# EAGLE design Main_board (EAGLE 9.6.2)

## Sheet 1 of 3
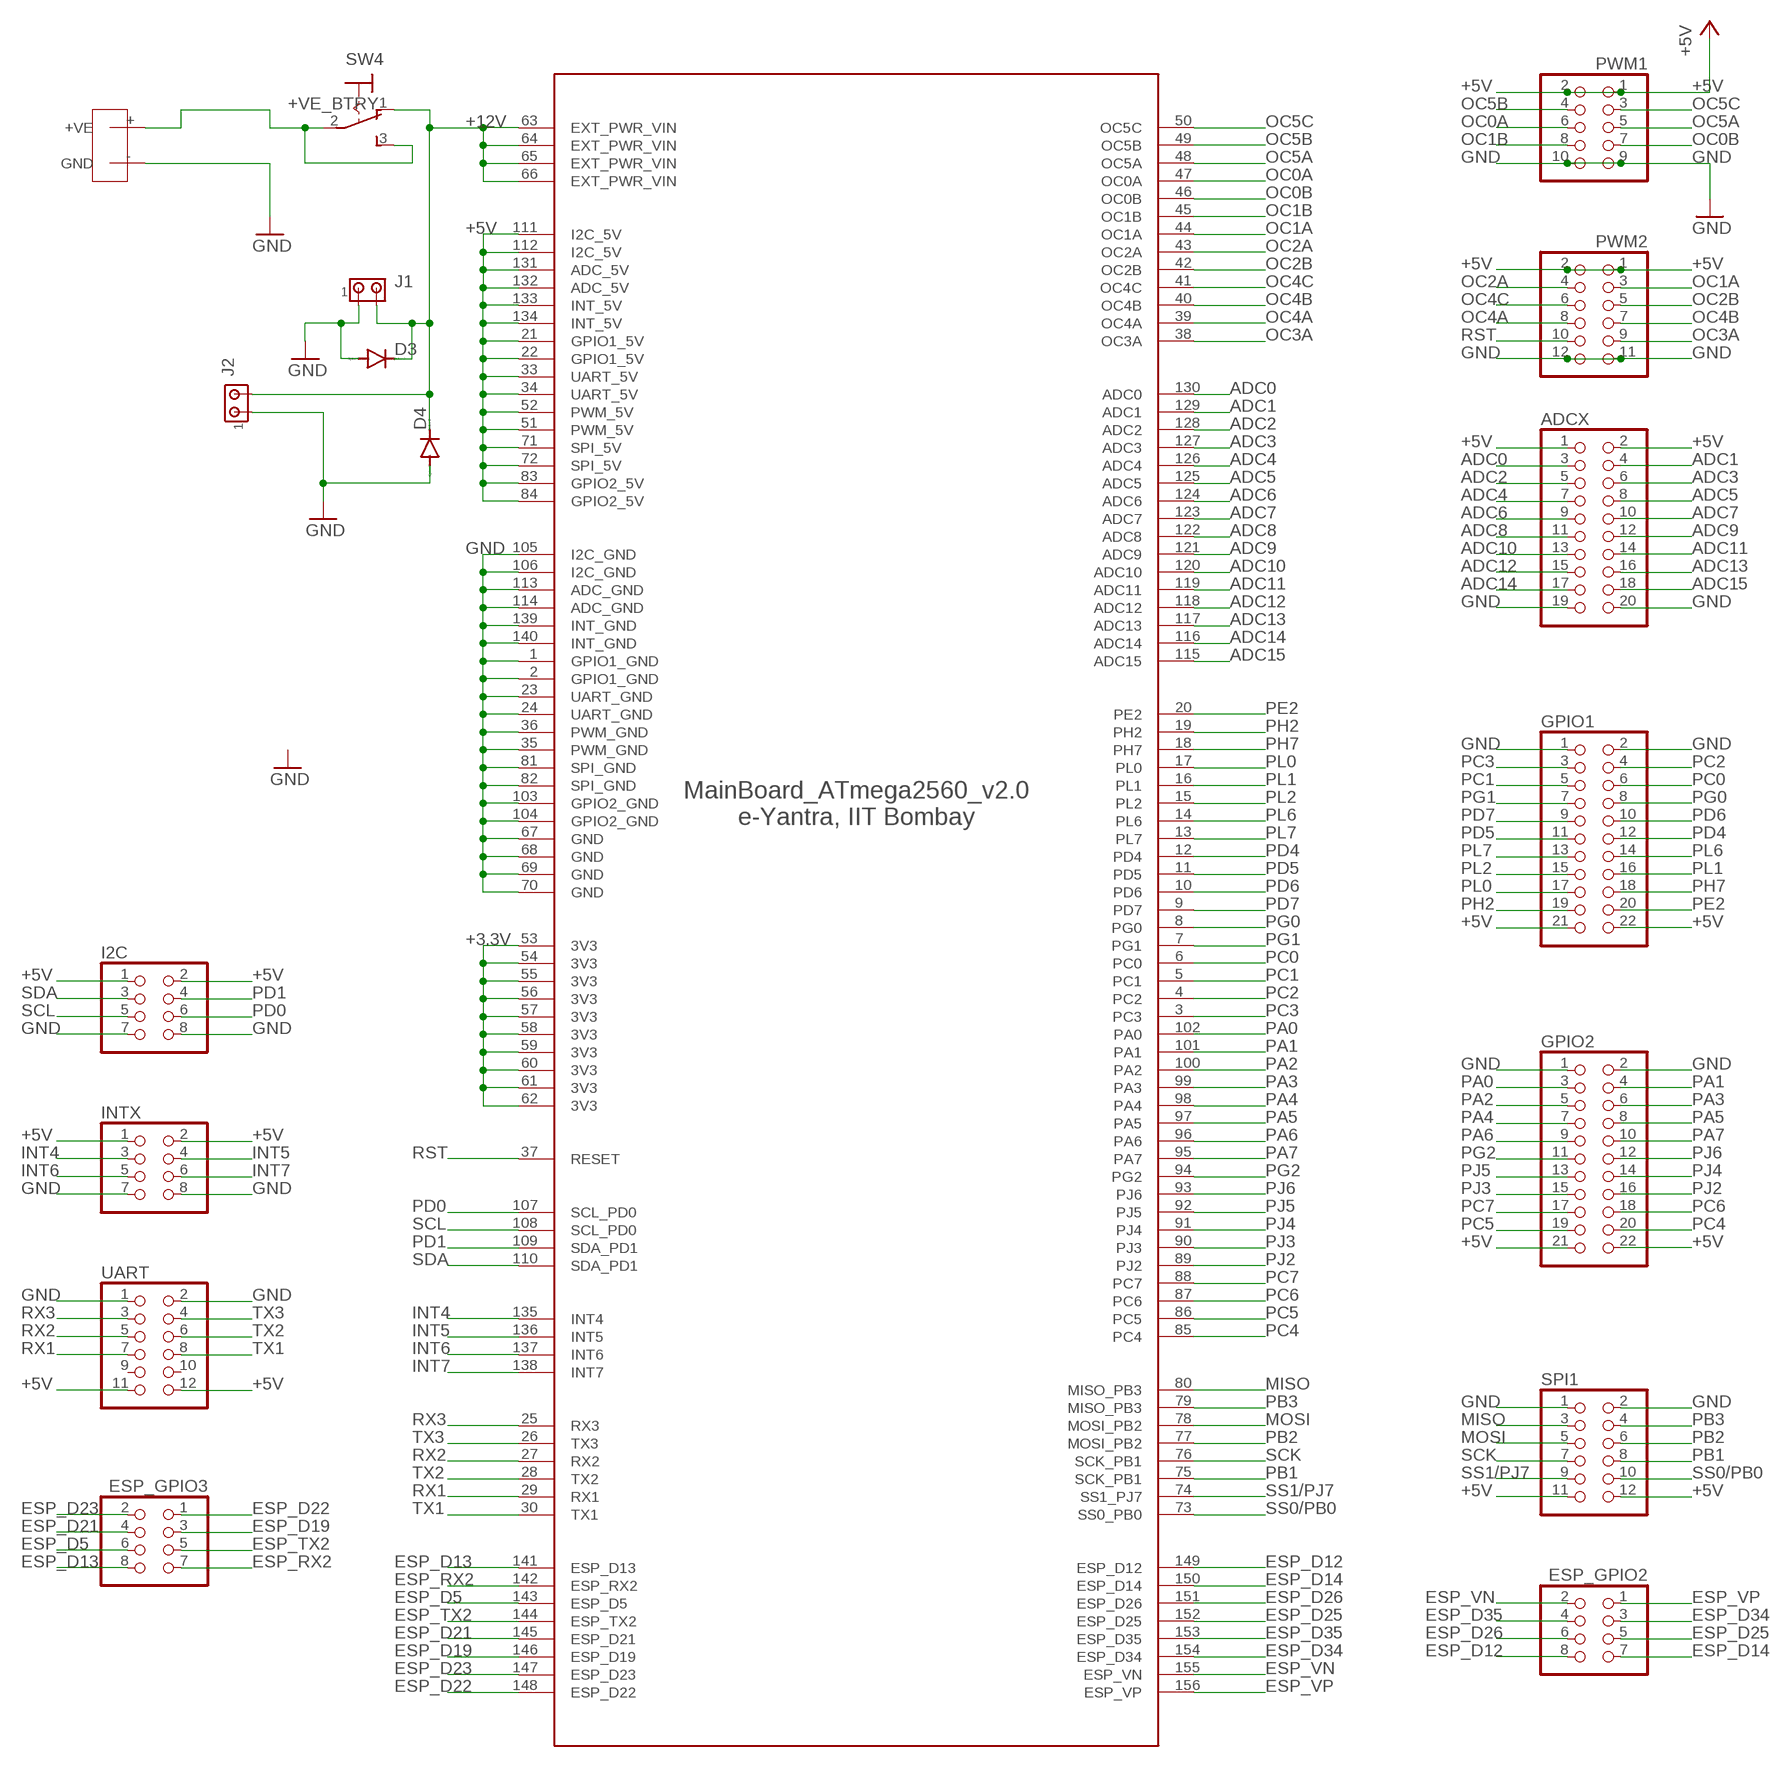
[diagram p0: schematic, sheet 1]

### Parts
ADCX  PINHD-2X10  [2X10]
D3  DIODE-DO214AC  [DO214AC]
D4  DIODE-DO214AC  [DO214AC]
ESP_GPIO2  PINHD-2X4  [2X04]
ESP_GPIO3  PINHD-2X4  [2X04]
EYFI_MEGA  ATMEGA2560_V2.0  [ATMEGA2560_V2.0]
GPIO1  PINHD-2X11  [2X11]
GPIO2  PINHD-2X11  [2X11]
I2C  PINHD-2X4  [2X04]
INTX  PINHD-2X4  [2X04]
J1  MTA02-156  [1X2MTA]
J2  MTA02-156  [1X2MTA]
PWM1  PINHD-2X5  [2X05]
PWM2  PINHD-2X6  [2X06]
SPI1  PINHD-2X6  [2X06]
SW4  M9040P  [M9040P]
U$1  DEANS  [DEANS]
UART  PINHD-2X6  [2X06]

### Nets
+3.3V: EYFI_MEGA.53(3V3) EYFI_MEGA.54(3V3) EYFI_MEGA.55(3V3) EYFI_MEGA.56(3V3) EYFI_MEGA.57(3V3) EYFI_MEGA.58(3V3) EYFI_MEGA.59(3V3) EYFI_MEGA.60(3V3) EYFI_MEGA.61(3V3) EYFI_MEGA.62(3V3) ; also sheet 2
+5V [+5V_SUPPLY]: ADCX.1 ADCX.2 EYFI_MEGA.21(GPIO1_5V) EYFI_MEGA.22(GPIO1_5V) EYFI_MEGA.33(UART_5V) EYFI_MEGA.34(UART_5V) EYFI_MEGA.51(PWM_5V) EYFI_MEGA.52(PWM_5V) EYFI_MEGA.71(SPI_5V) EYFI_MEGA.72(SPI_5V) EYFI_MEGA.83(GPIO2_5V) EYFI_MEGA.84(GPIO2_5V) EYFI_MEGA.111(I2C_5V) EYFI_MEGA.112(I2C_5V) EYFI_MEGA.131(ADC_5V) EYFI_MEGA.132(ADC_5V) EYFI_MEGA.133(INT_5V) EYFI_MEGA.134(INT_5V) GPIO1.21 GPIO1.22 GPIO2.21 GPIO2.22 I2C.1 I2C.2 INTX.1 INTX.2 PWM1.1 PWM1.2 PWM2.1 PWM2.2 SPI1.11 SPI1.12 UART.11 UART.12 ; also sheet 2
+12V [+12V_SUPPLY]: D3.C D4.C EYFI_MEGA.63(EXT_PWR_VIN) EYFI_MEGA.64(EXT_PWR_VIN) EYFI_MEGA.65(EXT_PWR_VIN) EYFI_MEGA.66(EXT_PWR_VIN) J1.2 J2.2 SW4.1(O)
+VE_BTRY [+12V_SUPPLY]: SW4.2(P) SW4.3(S) U$1.+(+VE)
ADC0: ADCX.3 EYFI_MEGA.130(ADC0) ; also sheet 2
ADC1: ADCX.4 EYFI_MEGA.129(ADC1) ; also sheet 2
ADC2: ADCX.5 EYFI_MEGA.128(ADC2) ; also sheet 2
ADC3: ADCX.6 EYFI_MEGA.127(ADC3) ; also sheet 2
ADC4: ADCX.7 EYFI_MEGA.126(ADC4)
ADC5: ADCX.8 EYFI_MEGA.125(ADC5)
ADC6: ADCX.9 EYFI_MEGA.124(ADC6)
ADC7: ADCX.10 EYFI_MEGA.123(ADC7)
ADC8: ADCX.11 EYFI_MEGA.122(ADC8)
ADC9: ADCX.12 EYFI_MEGA.121(ADC9)
ADC10: ADCX.13 EYFI_MEGA.120(ADC10)
ADC11: ADCX.14 EYFI_MEGA.119(ADC11)
ADC12: ADCX.15 EYFI_MEGA.118(ADC12) ; also sheet 2
ADC13: ADCX.16 EYFI_MEGA.117(ADC13) ; also sheet 2
ADC14: ADCX.17 EYFI_MEGA.116(ADC14) ; also sheet 2
ADC15: ADCX.18 EYFI_MEGA.115(ADC15) ; also sheet 2
ESP_D5: ESP_GPIO3.6 EYFI_MEGA.143(ESP_D5)
ESP_D12: ESP_GPIO2.8 EYFI_MEGA.149(ESP_D12)
ESP_D13: ESP_GPIO3.8 EYFI_MEGA.141(ESP_D13)
ESP_D14: ESP_GPIO2.7 EYFI_MEGA.150(ESP_D14)
ESP_D19: ESP_GPIO3.3 EYFI_MEGA.146(ESP_D19)
ESP_D21: ESP_GPIO3.4 EYFI_MEGA.145(ESP_D21)
ESP_D22: ESP_GPIO3.1 EYFI_MEGA.148(ESP_D22)
ESP_D23: ESP_GPIO3.2 EYFI_MEGA.147(ESP_D23)
ESP_D25: ESP_GPIO2.5 EYFI_MEGA.152(ESP_D25)
ESP_D26: ESP_GPIO2.6 EYFI_MEGA.151(ESP_D26)
ESP_D34: ESP_GPIO2.3 EYFI_MEGA.154(ESP_D34)
ESP_D35: ESP_GPIO2.4 EYFI_MEGA.153(ESP_D35)
ESP_RX2: ESP_GPIO3.7 EYFI_MEGA.142(ESP_RX2)
ESP_TX2: ESP_GPIO3.5 EYFI_MEGA.144(ESP_TX2)
ESP_VN: ESP_GPIO2.2 EYFI_MEGA.155(ESP_VN)
ESP_VP: ESP_GPIO2.1 EYFI_MEGA.156(ESP_VP)
GND: ADCX.19 ADCX.20 D3.A D4.A EYFI_MEGA.1(GPIO1_GND) EYFI_MEGA.2(GPIO1_GND) EYFI_MEGA.23(UART_GND) EYFI_MEGA.24(UART_GND) EYFI_MEGA.35(PWM_GND) EYFI_MEGA.36(PWM_GND) EYFI_MEGA.67(GND) EYFI_MEGA.68(GND) EYFI_MEGA.69(GND) EYFI_MEGA.70(GND) EYFI_MEGA.81(SPI_GND) EYFI_MEGA.82(SPI_GND) EYFI_MEGA.103(GPIO2_GND) EYFI_MEGA.104(GPIO2_GND) EYFI_MEGA.105(I2C_GND) EYFI_MEGA.106(I2C_GND) EYFI_MEGA.113(ADC_GND) EYFI_MEGA.114(ADC_GND) EYFI_MEGA.139(INT_GND) EYFI_MEGA.140(INT_GND) GPIO1.1 GPIO1.2 GPIO2.1 GPIO2.2 I2C.7 I2C.8 INTX.7 INTX.8 J1.1 J2.1 PWM1.9 PWM1.10 PWM2.11 PWM2.12 SPI1.1 SPI1.2 U$1.-(GND) UART.1 UART.2 ; also sheet 2
INT4: EYFI_MEGA.135(INT4) INTX.3 ; also sheet 2
INT5: EYFI_MEGA.136(INT5) INTX.4 ; also sheet 2
INT6: EYFI_MEGA.137(INT6) INTX.5 ; also sheet 2
INT7: EYFI_MEGA.138(INT7) INTX.6 ; also sheet 2
MISO: EYFI_MEGA.80(MISO_PB3) SPI1.3
MOSI: EYFI_MEGA.78(MOSI_PB2) SPI1.5
OC0A: EYFI_MEGA.47(OC0A) PWM1.6
OC0B: EYFI_MEGA.46(OC0B) PWM1.7
OC1A: EYFI_MEGA.44(OC1A) PWM2.3
OC1B: EYFI_MEGA.45(OC1B) PWM1.8 ; also sheet 2
OC2A: EYFI_MEGA.43(OC2A) PWM2.4
OC2B: EYFI_MEGA.42(OC2B) PWM2.5 ; also sheet 2
OC3A: EYFI_MEGA.38(OC3A) PWM2.9 ; also sheet 2
OC4A: EYFI_MEGA.39(OC4A) PWM2.8 ; also sheet 2
OC4B: EYFI_MEGA.40(OC4B) PWM2.7 ; also sheet 2
OC4C: EYFI_MEGA.41(OC4C) PWM2.6 ; also sheet 2
OC5A: EYFI_MEGA.48(OC5A) PWM1.5 ; also sheet 2
OC5B: EYFI_MEGA.49(OC5B) PWM1.4 ; also sheet 2
OC5C: EYFI_MEGA.50(OC5C) PWM1.3
PA0: EYFI_MEGA.102(PA0) GPIO2.3 ; also sheet 2
PA1: EYFI_MEGA.101(PA1) GPIO2.4 ; also sheet 2
PA2: EYFI_MEGA.100(PA2) GPIO2.5 ; also sheet 2
PA3: EYFI_MEGA.99(PA3) GPIO2.6 ; also sheet 2
PA4: EYFI_MEGA.98(PA4) GPIO2.7 ; also sheet 2
PA5: EYFI_MEGA.97(PA5) GPIO2.8 ; also sheet 2
PA6: EYFI_MEGA.96(PA6) GPIO2.9 ; also sheet 2
PA7: EYFI_MEGA.95(PA7) GPIO2.10 ; also sheet 2
PB1: EYFI_MEGA.75(SCK_PB1) SPI1.8
PB2: EYFI_MEGA.77(MOSI_PB2) SPI1.6
PB3: EYFI_MEGA.79(MISO_PB3) SPI1.4
PC0: EYFI_MEGA.6(PC0) GPIO1.6 ; also sheet 2
PC1: EYFI_MEGA.5(PC1) GPIO1.5 ; also sheet 2
PC2: EYFI_MEGA.4(PC2) GPIO1.4 ; also sheet 2
PC3: EYFI_MEGA.3(PC3) GPIO1.3 ; also sheet 2
PC4: EYFI_MEGA.85(PC4) GPIO2.20 ; also sheet 2
PC5: EYFI_MEGA.86(PC5) GPIO2.19 ; also sheet 2
PC6: EYFI_MEGA.87(PC6) GPIO2.18 ; also sheet 2
PC7: EYFI_MEGA.88(PC7) GPIO2.17 ; also sheet 2
PD0: EYFI_MEGA.107(SCL_PD0) I2C.6
PD1: EYFI_MEGA.109(SDA_PD1) I2C.4
PD4: EYFI_MEGA.12(PD4) GPIO1.12 ; also sheet 2
PD5: EYFI_MEGA.11(PD5) GPIO1.11 ; also sheet 2
PD6: EYFI_MEGA.10(PD6) GPIO1.10 ; also sheet 2
PD7: EYFI_MEGA.9(PD7) GPIO1.9 ; also sheet 2
PE2: EYFI_MEGA.20(PE2) GPIO1.20
PG0: EYFI_MEGA.8(PG0) GPIO1.8
PG1: EYFI_MEGA.7(PG1) GPIO1.7
PG2: EYFI_MEGA.94(PG2) GPIO2.11 ; also sheet 2
PH2: EYFI_MEGA.19(PH2) GPIO1.19
PH7: EYFI_MEGA.18(PH7) GPIO1.18
PJ2: EYFI_MEGA.89(PJ2) GPIO2.16
PJ3: EYFI_MEGA.90(PJ3) GPIO2.15
PJ4: EYFI_MEGA.91(PJ4) GPIO2.14
PJ5: EYFI_MEGA.92(PJ5) GPIO2.13
PJ6: EYFI_MEGA.93(PJ6) GPIO2.12 ; also sheet 2
PL0: EYFI_MEGA.17(PL0) GPIO1.17
PL1: EYFI_MEGA.16(PL1) GPIO1.16
PL2: EYFI_MEGA.15(PL2) GPIO1.15
PL6: EYFI_MEGA.14(PL6) GPIO1.14
PL7: EYFI_MEGA.13(PL7) GPIO1.13
RST: EYFI_MEGA.37(RESET) PWM2.10
RX1: EYFI_MEGA.29(RX1) UART.7 ; also sheet 2
RX2: EYFI_MEGA.27(RX2) UART.5
RX3: EYFI_MEGA.25(RX3) UART.3
SCK: EYFI_MEGA.76(SCK_PB1) SPI1.7
SCL: EYFI_MEGA.108(SCL_PD0) I2C.5 ; also sheet 2
SDA: EYFI_MEGA.110(SDA_PD1) I2C.3 ; also sheet 2
SS0/PB0: EYFI_MEGA.73(SS0_PB0) SPI1.10
SS1/PJ7: EYFI_MEGA.74(SS1_PJ7) SPI1.9
TX1: EYFI_MEGA.30(TX1) UART.8
TX2: EYFI_MEGA.28(TX2) UART.6
TX3: EYFI_MEGA.26(TX3) UART.4
Unconnected: UART.9 UART.10

## Sheet 2 of 3
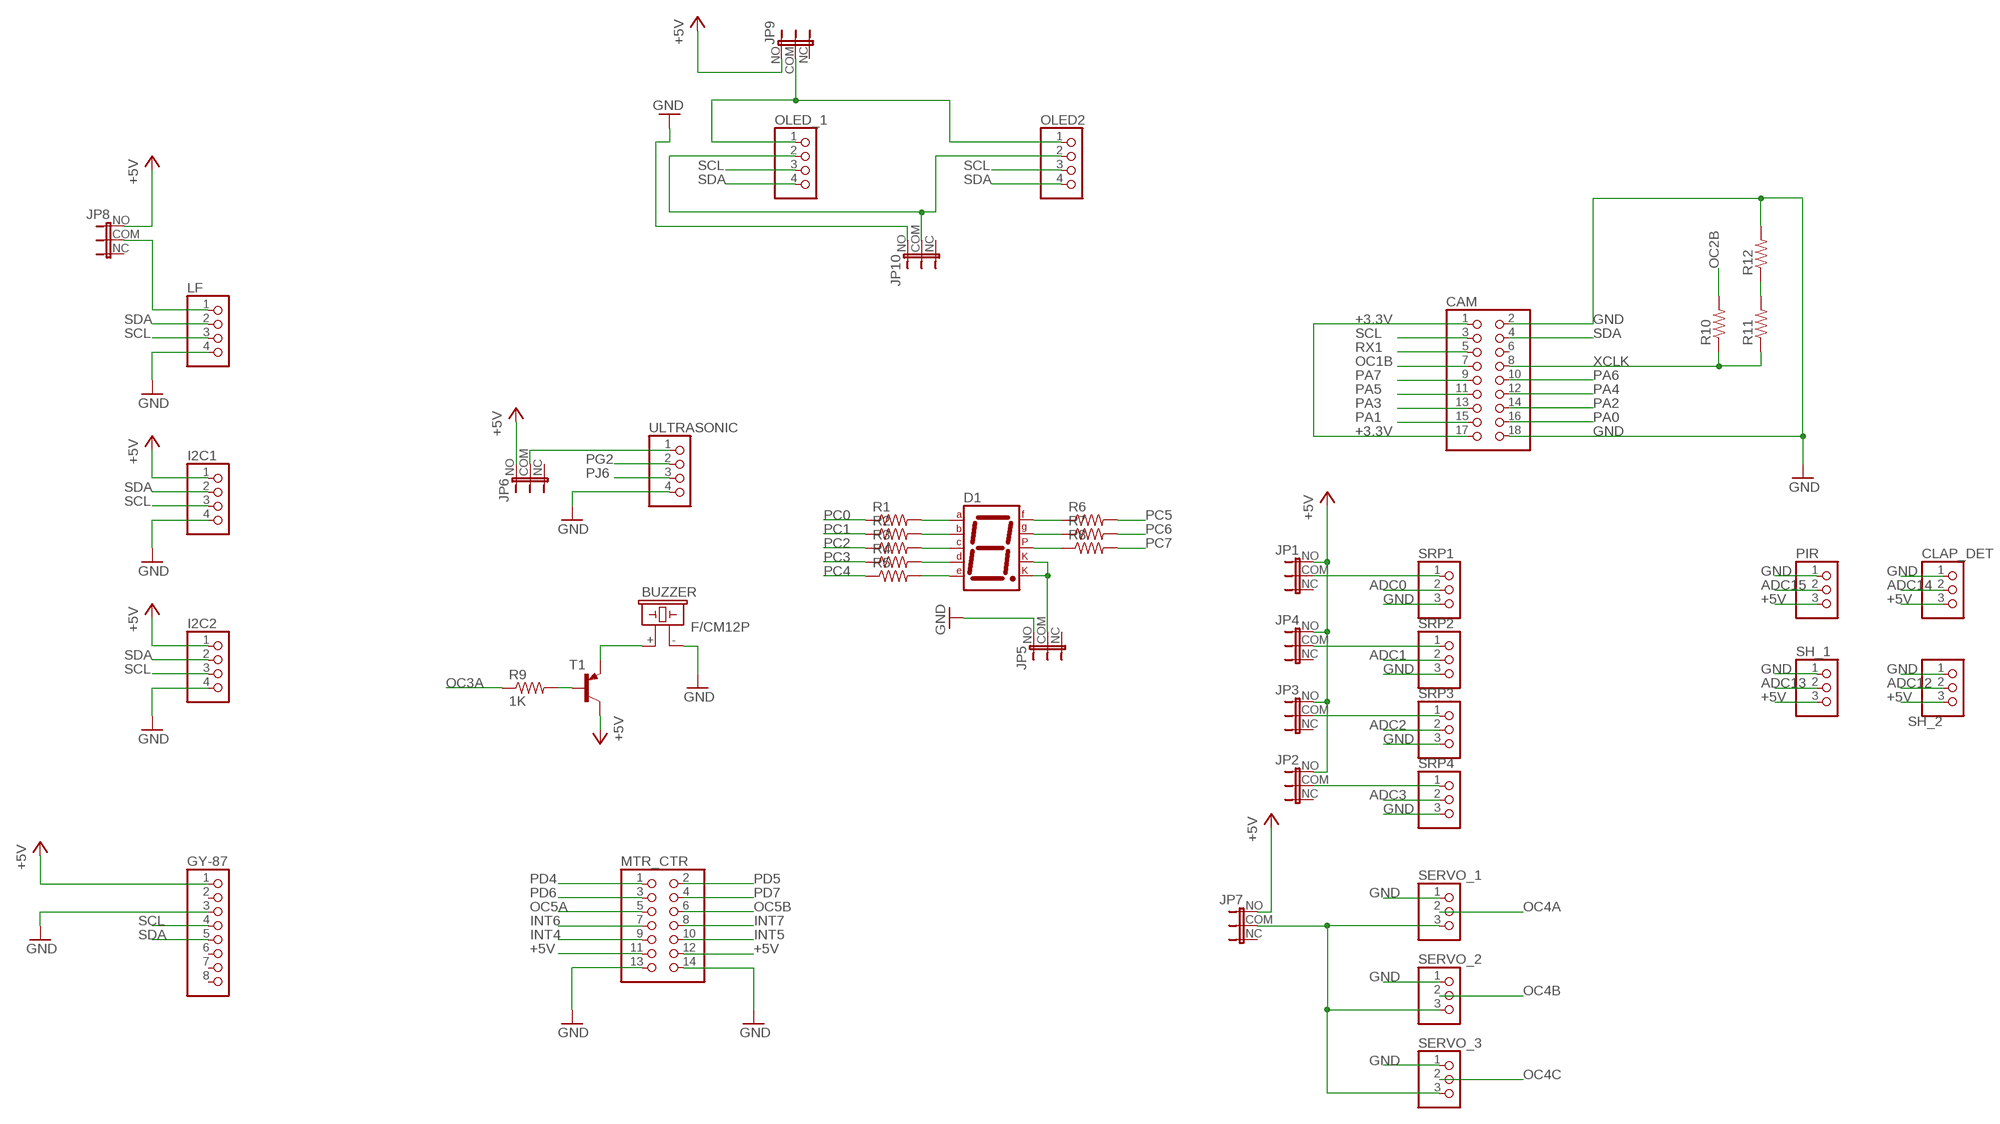
[diagram p1: schematic, sheet 2]

### Parts
BUZZER  F/CM12P  [F/CM12P]
CAM  PINHD-2X9  [2X09]
CLAP_DET  PINHD-1X3  [1X03]
D1  7SEG-CK  [7SEG-13]
GY-87  PINHD-1X8  [1X08]
I2C1  PINHD-1X4  [1X04]
I2C2  PINHD-1X4  [1X04]
JP1  JP2E  [JP2]
JP2  JP2E  [JP2]
JP3  JP2E  [JP2]
JP4  JP2E  [JP2]
JP5  JP2E  [JP2]
JP6  JP2E  [JP2]
JP7  JP2E  [JP2]
JP8  JP2E  [JP2]
JP9  JP2E  [JP2]
JP10  JP2E  [JP2]
LF  PINHD-1X4  [1X04]
MTR_CTR  PINHD-2X7  [2X07]
OLED2  PINHD-1X4  [1X04]
OLED_1  PINHD-1X4  [1X04]
PIR  PINHD-1X3  [1X03]
R1  R-US_R1206  [R1206]
R2  R-US_R1206  [R1206]
R3  R-US_R1206  [R1206]
R4  R-US_R1206  [R1206]
R5  R-US_R1206  [R1206]
R6  R-US_R1206  [R1206]
R7  R-US_R1206  [R1206]
R8  R-US_R1206  [R1206]
R9  1K  R-US_R1206  [R1206]
R10  R-US_R1206  [R1206]
R11  R-US_R1206  [R1206]
R12  R-US_R1206  [R1206]
SERVO_1  PINHD-1X3  [1X03]
SERVO_2  PINHD-1X3  [1X03]
SERVO_3  PINHD-1X3  [1X03]
SH_1  PINHD-1X3  [1X03]
SH_2  PINHD-1X3  [1X03]
SRP1  PINHD-1X3  [1X03]
SRP2  PINHD-1X3  [1X03]
SRP3  PINHD-1X3  [1X03]
SRP4  PINHD-1X3  [1X03]
T1  BC807-16-PNP-SOT23-BEC  [SOT23-BEC]
ULTRASONIC  PINHD-1X4  [1X04]

### Nets
+3.3V: CAM.1 CAM.17 ; also sheet 1
+5V [+5V_SUPPLY]: CLAP_DET.3 GY-87.1 I2C1.1 I2C2.1 JP1.NO JP2.NO JP3.NO JP4.NO JP6.NO JP7.NO JP8.NO JP9.NO MTR_CTR.11 MTR_CTR.12 PIR.3 SH_1.3 SH_2.3 T1.C ; also sheet 1
ADC0: SRP1.2 ; also sheet 1
ADC1: SRP2.2 ; also sheet 1
ADC2: SRP3.2 ; also sheet 1
ADC3: SRP4.2 ; also sheet 1
ADC12: SH_2.2 ; also sheet 1
ADC13: SH_1.2 ; also sheet 1
ADC14: CLAP_DET.2 ; also sheet 1
ADC15: PIR.2 ; also sheet 1
GND: BUZZER.- CAM.2 CAM.18 CLAP_DET.1 GY-87.3 I2C1.4 I2C2.4 JP5.NO JP10.NO LF.4 MTR_CTR.13 MTR_CTR.14 PIR.1 R12.2 SERVO_1.1 SERVO_2.1 SERVO_3.1 SH_1.1 SH_2.1 SRP1.3 SRP2.3 SRP3.3 SRP4.3 ULTRASONIC.4 ; also sheet 1
INT4: MTR_CTR.9 ; also sheet 1
INT5: MTR_CTR.10 ; also sheet 1
INT6: MTR_CTR.7 ; also sheet 1
INT7: MTR_CTR.8 ; also sheet 1
N$2: D1.7(A) R1.2
N$3: BUZZER.+ T1.E
N$4: D1.6(B) R2.2
N$5: R9.2 T1.B
N$6: D1.4(C) R3.2
N$7: D1.2(D) R4.2
N$8: D1.1(E) R5.2
N$9: D1.9(F) R6.1
N$10: D1.10(G) R7.1
N$11: D1.5(DP) R8.1
N$12 [+5V_SUPPLY]: JP6.COM ULTRASONIC.1
N$13: D1.3(CK1) D1.8(CK2) JP5.COM
N$14 [+5V_SUPPLY]: JP9.COM OLED2.1 OLED_1.1
N$15: JP10.COM OLED2.2 OLED_1.2
N$16: JP8.COM LF.1
N$17: R11.2 R12.1
N$18: JP4.COM SRP2.1
N$19 [+5V_SUPPLY]: JP2.COM SRP4.1
N$20: JP3.COM SRP3.1
N$21: JP1.COM SRP1.1
N$23 [+5V_SUPPLY]: JP7.COM SERVO_1.3 SERVO_2.3 SERVO_3.3
OC1B: CAM.7 ; also sheet 1
OC2B: R10.2 ; also sheet 1
OC3A: R9.1 ; also sheet 1
OC4A: SERVO_1.2 ; also sheet 1
OC4B: SERVO_2.2 ; also sheet 1
OC4C: SERVO_3.2 ; also sheet 1
OC5A: MTR_CTR.5 ; also sheet 1
OC5B: MTR_CTR.6 ; also sheet 1
PA0: CAM.16 ; also sheet 1
PA1: CAM.15 ; also sheet 1
PA2: CAM.14 ; also sheet 1
PA3: CAM.13 ; also sheet 1
PA4: CAM.12 ; also sheet 1
PA5: CAM.11 ; also sheet 1
PA6: CAM.10 ; also sheet 1
PA7: CAM.9 ; also sheet 1
PC0: R1.1 ; also sheet 1
PC1: R2.1 ; also sheet 1
PC2: R3.1 ; also sheet 1
PC3: R4.1 ; also sheet 1
PC4: R5.1 ; also sheet 1
PC5: R6.2 ; also sheet 1
PC6: R7.2 ; also sheet 1
PC7: R8.2 ; also sheet 1
PD4: MTR_CTR.1 ; also sheet 1
PD5: MTR_CTR.2 ; also sheet 1
PD6: MTR_CTR.3 ; also sheet 1
PD7: MTR_CTR.4 ; also sheet 1
PG2: ULTRASONIC.2 ; also sheet 1
PJ6: ULTRASONIC.3 ; also sheet 1
RX1: CAM.5 ; also sheet 1
SCL: CAM.3 GY-87.4 I2C1.3 I2C2.3 LF.3 OLED2.3 OLED_1.3 ; also sheet 1
SDA: CAM.4 GY-87.5 I2C1.2 I2C2.2 LF.2 OLED2.4 OLED_1.4 ; also sheet 1
XCLK: CAM.8 R10.1 R11.1
Unconnected: CAM.6 GY-87.2 GY-87.6 GY-87.7 GY-87.8 JP1.NC JP2.NC JP3.NC JP4.NC JP5.NC JP6.NC JP7.NC JP8.NC JP9.NC JP10.NC

## Sheet 3 of 3

## Library data of the parts
ADCX = pinhead:PINHD-2X10: PIN HEADER
BUZZER = buzzer:F/CM12P: BUZZER Source: Buerklin; OC_FARNELL: unknown; OC_NEWARK: unknown
CAM = pinhead:PINHD-2X9: PIN HEADER
CLAP_DET PIR SERVO_1-SERVO_3 SH_1 SH_2 SRP1-SRP4 = pinhead:PINHD-1X3: PIN HEADER
D1 = special:7SEG-CK: 7-segment DISPLAY single cathode, 13 mm
D3 D4 = diode:DIODE-: DIODE
ESP_GPIO2 ESP_GPIO3 I2C INTX = pinhead:PINHD-2X4: PIN HEADER
EYFI_MEGA = eYFi-Mega_v2.0.1:ATMEGA2560_V2.0
GPIO1 GPIO2 = pinhead:PINHD-2X11: PIN HEADER
GY-87 = pinhead:PINHD-1X8: PIN HEADER
I2C1 I2C2 LF OLED2 OLED_1 ULTRASONIC = pinhead:PINHD-1X4: PIN HEADER
J1 J2 = con-amp:MTA02-156: AMP connector
JP1-JP10 = jumper:JP2E: JUMPER
MTR_CTR = pinhead:PINHD-2X7: PIN HEADER
PWM1 = pinhead:PINHD-2X5: PIN HEADER
PWM2 SPI1 UART = pinhead:PINHD-2X6: PIN HEADER
R1-R12 = rcl:R-US_: RESISTOR, American symbol; SPICEPREFIX: R
SW4 = switch:M9040P: TOGGLE SWITCH Marquardt
T1 = transistor:*-PNP-: PNP Transistror
U$1 = DEANS:DEANS

## Net classes
0 default: width 0.305 mm
1 +5V_SUPPLY: width 0.813 mm
2 +12V_SUPPLY: width 1.27 mm

## Board
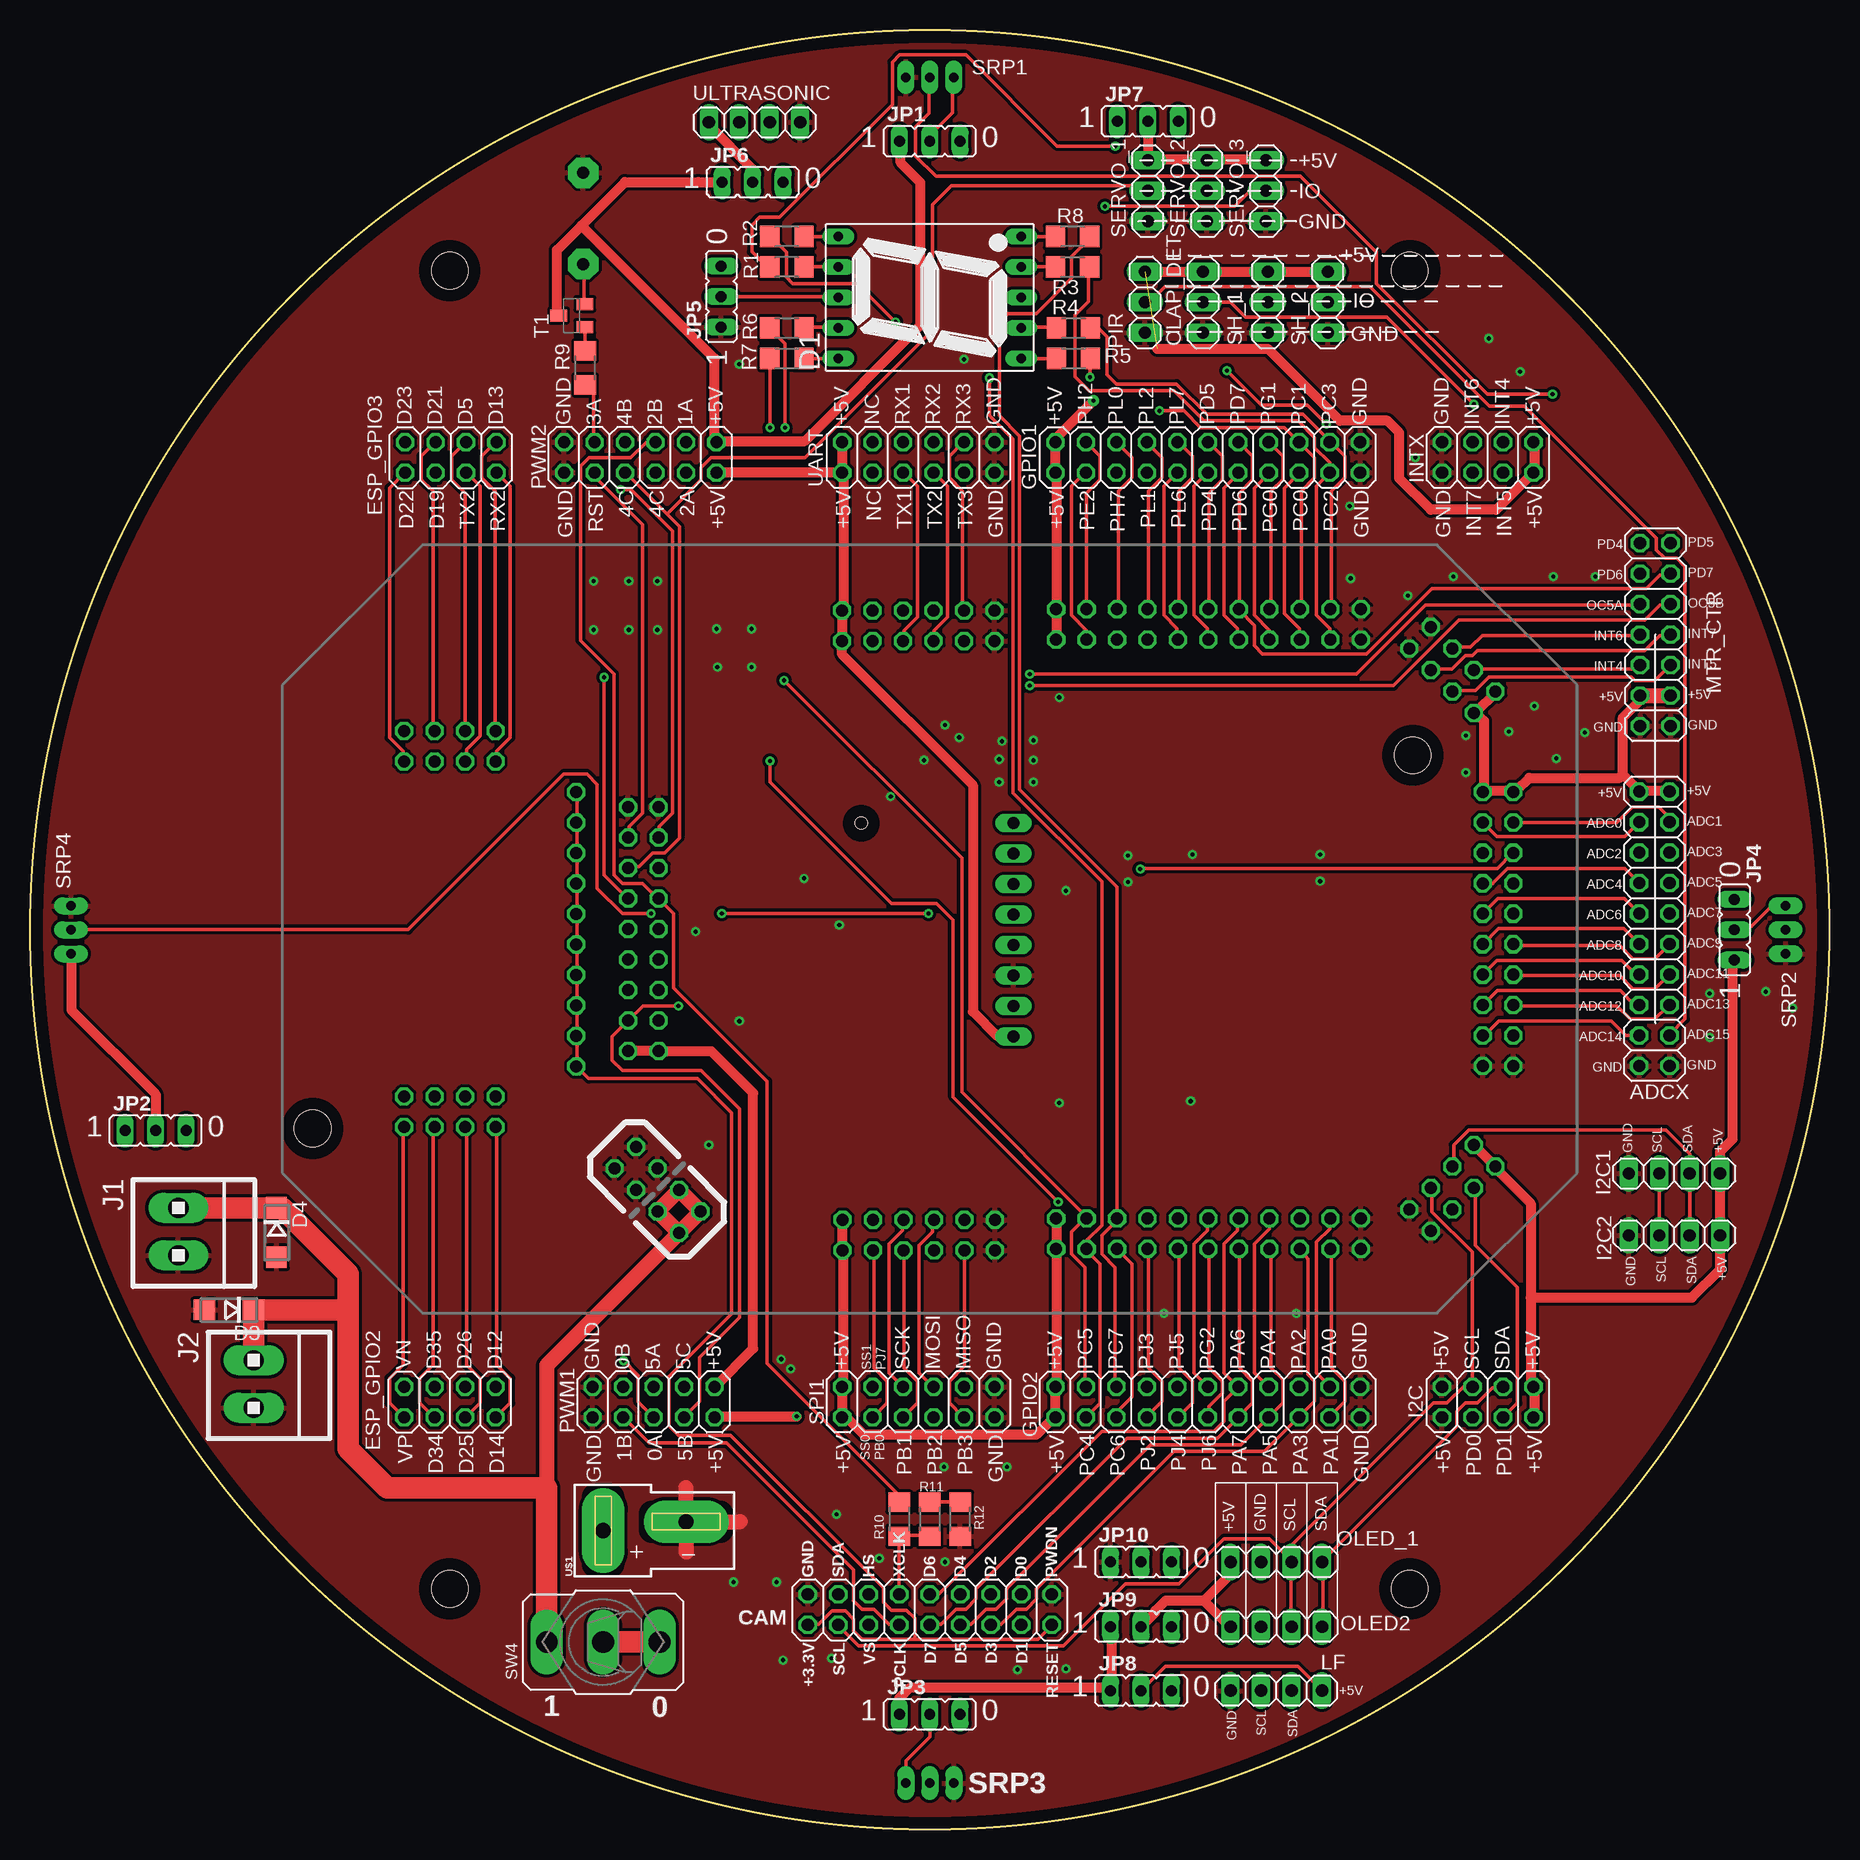
[diagram p2: board, top side]
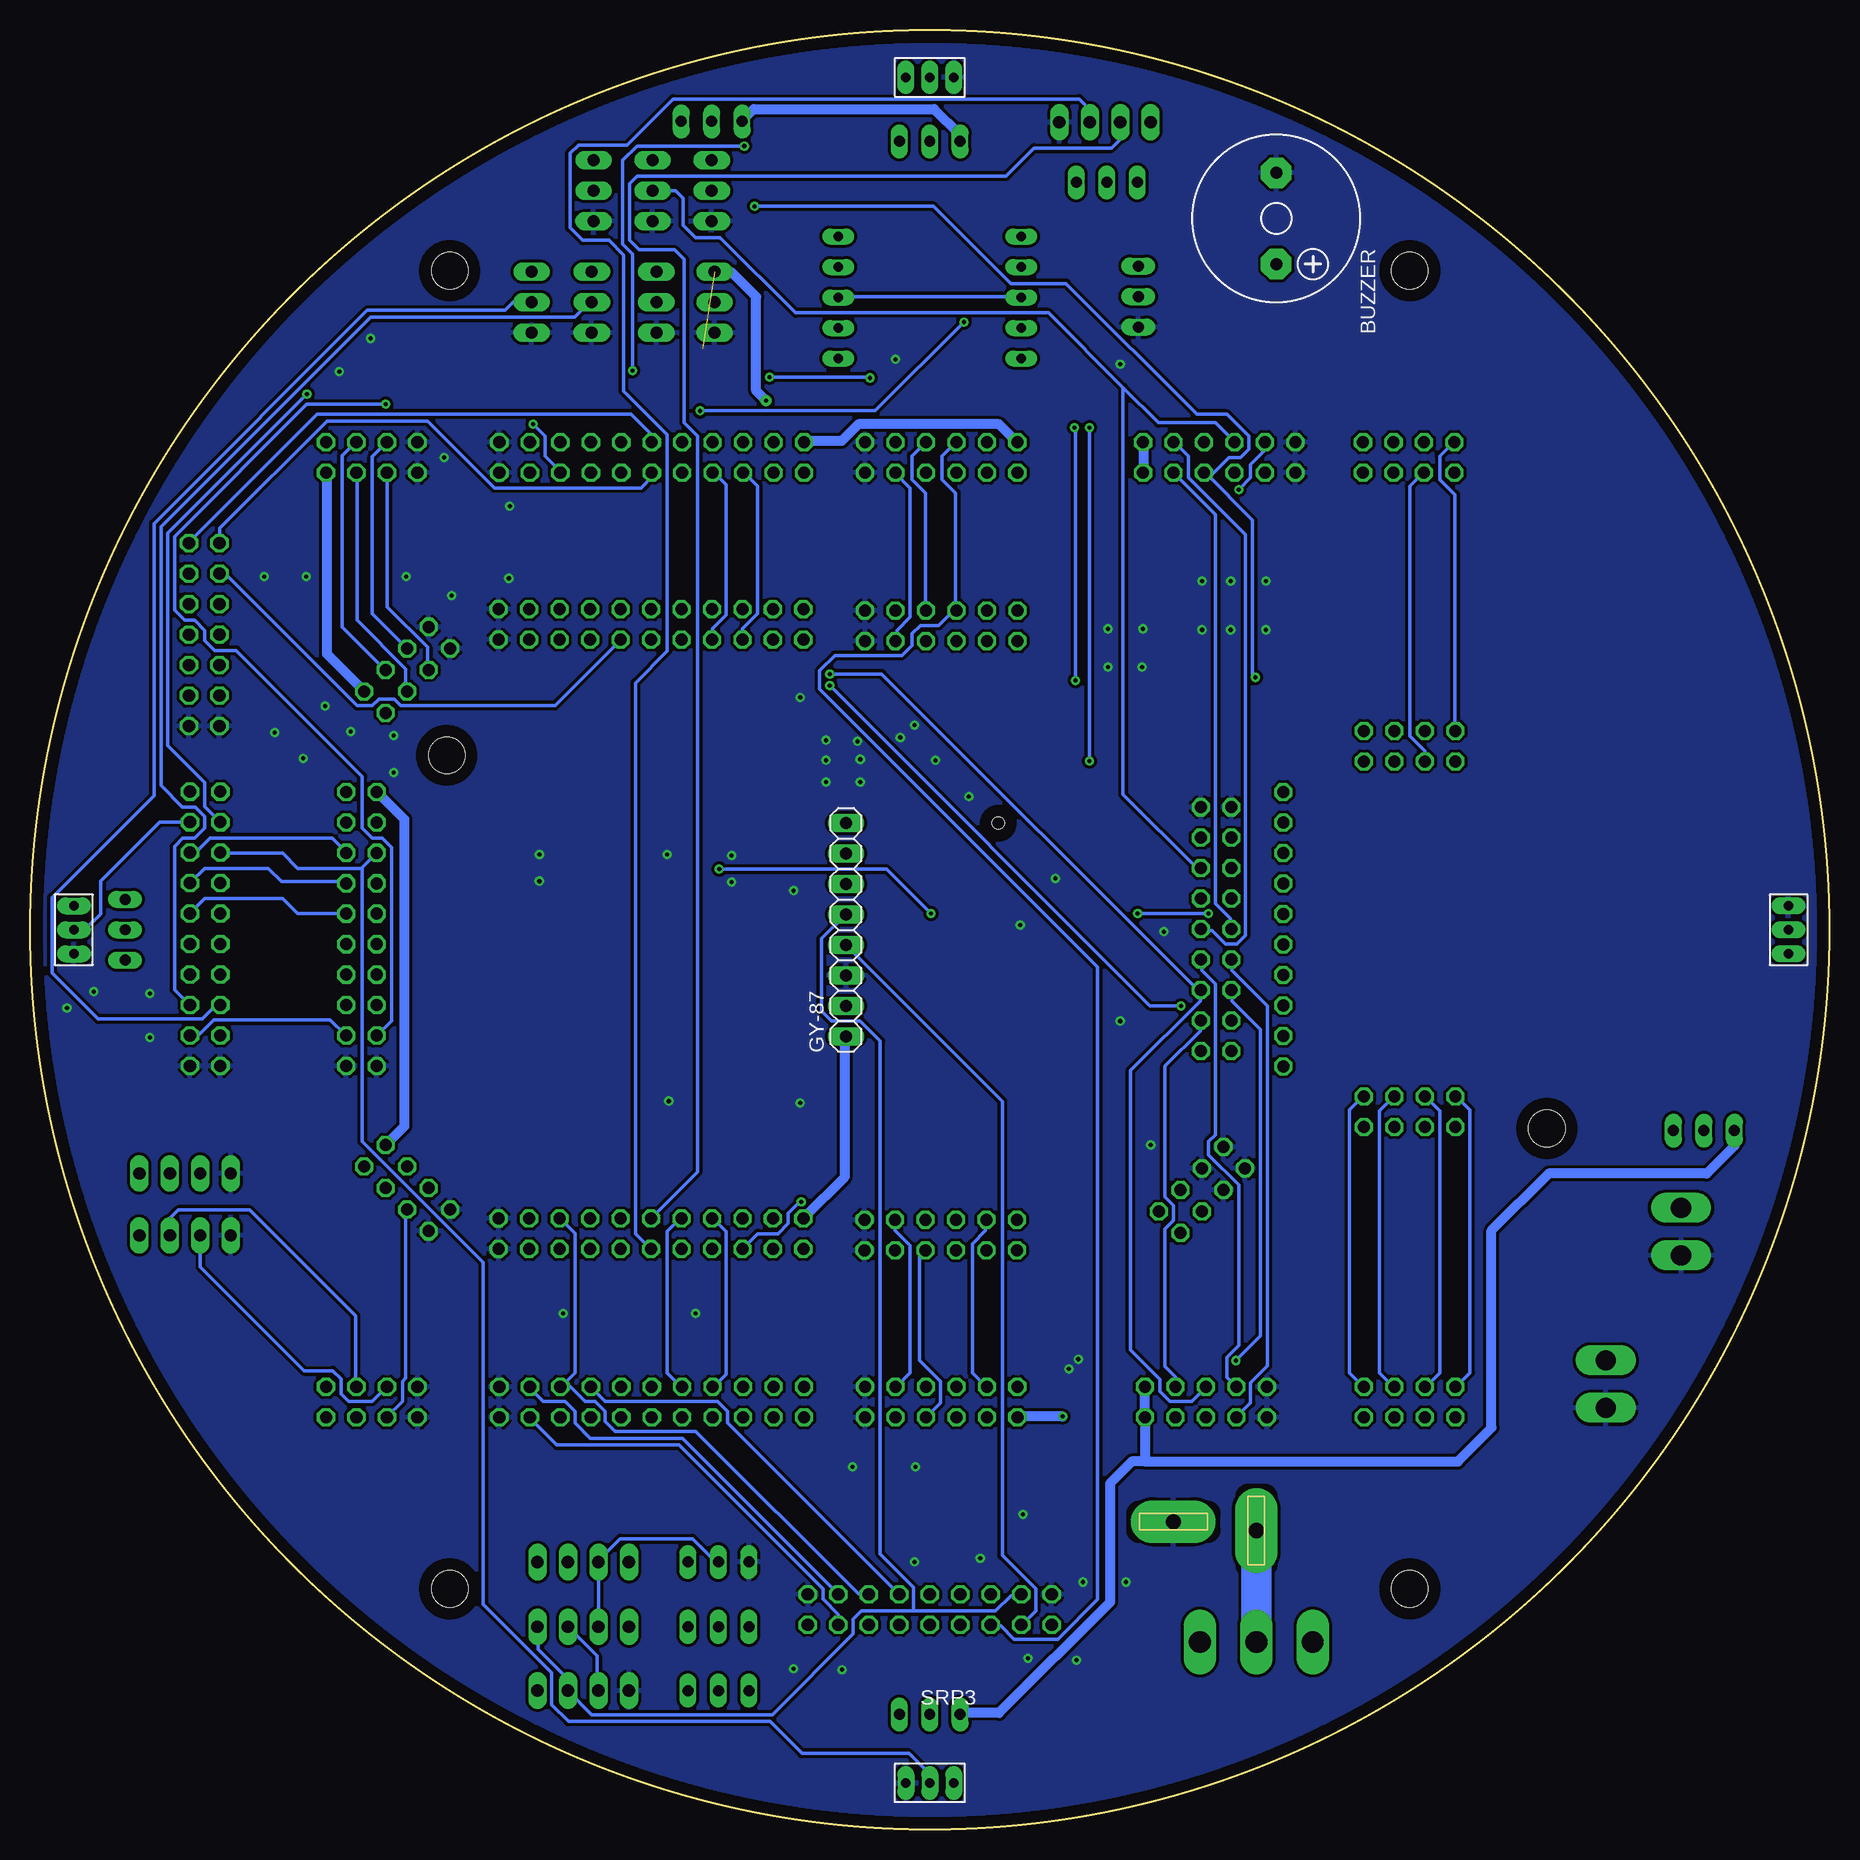
[diagram p3: board, bottom side, seen from below]

Size 150 x 150 mm. Coordinates in mm from the lower left corner, seen from the top.
Outline: circle at 75,75 radius 75
Copper layers (1*16): Top 0.035mm / dielectric 0.15mm / Bottom 0.035mm
Design rules "default *": minimum track width 12mil, minimum drill 0.35mm, track to track 10mil, track to pad 10mil, pad to pad 10mil, via to via 8mil, smd to smd 8mil, copper to edge 40mil, drill to drill 8mil, minimum pad ring 10mil, minimum via ring 8mil, stop-mask expansion 4mil, vias tented up to drill 0mil, thermal gap 10mil
Holes 1 mm at 69.28,83.89
Holes 3.05 mm at 115,129.93 115,20.07 34.99,20.07 34.99,129.93

### Footprints (pad centres in the part's own frame; a part is rotated, then mirrored left to right if it is on the bottom)
2X10 = drill 1.016 octagon: 1 -11.43,-1.27; 2 -11.43,1.27; 3 -8.89,-1.27; 4 -8.89,1.27; 5 -6.35,-1.27; 6 -6.35,1.27; 7 -3.81,-1.27; 8 -3.81,1.27; 9 -1.27,-1.27; 10 -1.27,1.27; 11 1.27,-1.27; 12 1.27,1.27; 13 3.81,-1.27; 14 3.81,1.27; 15 6.35,-1.27; 16 6.35,1.27; 17 8.89,-1.27; 18 8.89,1.27; 19 11.43,-1.27; 20 11.43,1.27
F/CM12P = drill 1.016 pad 2.54 octagon: + 3.81,0; - -3.81,0
2X09 = drill 1.016 octagon: 1 -10.16,-1.27; 2 -10.16,1.27; 3 -7.62,-1.27; 4 -7.62,1.27; 5 -5.08,-1.27; 6 -5.08,1.27; 7 -2.54,-1.27; 8 -2.54,1.27; 9 0,-1.27; 10 0,1.27; 11 2.54,-1.27; 12 2.54,1.27; 13 5.08,-1.27; 14 5.08,1.27; 15 7.62,-1.27; 16 7.62,1.27; 17 10.16,-1.27; 18 10.16,1.27
1X03 = drill 1.016 long: 1 -2.54,0; 2 0,0; 3 2.54,0
7SEG-13 = drill 0.813 long: 1 -5.08,-7.62; 2 -2.54,-7.62; 3 0,-7.62; 4 2.54,-7.62; 5 5.08,-7.62; 6 5.08,7.62; 7 2.54,7.62; 8 0,7.62; 9 -2.54,7.62; 10 -5.08,7.62
DO214AC = smd 1.8 x 1.7: A 2.05,0; C -2.05,0
2X04 = drill 1.016 octagon: 1 -3.81,-1.27; 2 -3.81,1.27; 3 -1.27,-1.27; 4 -1.27,1.27; 5 1.27,-1.27; 6 1.27,1.27; 7 3.81,-1.27; 8 3.81,1.27
ATMEGA2560_V2.0 = drill 1 octagon: 1 5.344,89.916; 2 7.884,89.916; 3 5.344,87.376; 4 7.884,87.376; 5 5.344,84.836; 6 7.884,84.836; 7 5.344,82.296; 8 7.884,82.296; 9 5.344,79.756; 10 7.884,79.756; 11 5.344,77.216; 12 7.884,77.216; 13 5.344,74.676; 14 7.884,74.676; 15 5.344,72.136; 16 7.884,72.136; 17 5.344,69.596; 18 7.884,69.596; 19 5.344,67.056; 20 7.884,67.056; 21 5.344,64.516; 22 7.884,64.516; 23 5.461,59.373; 24 8.001,59.373; 25 5.461,56.833; 26 8.001,56.833; 27 5.461,54.292; 28 8.001,54.292; 29 5.461,51.752; 30 8.001,51.752; 31 5.461,49.212; 32 8.001,49.212; 33 5.461,46.672; 34 8.001,46.672; 35 21.857,28.839; 36 21.857,31.379; 37 24.397,28.839; 38 24.397,31.379; 39 26.937,28.839; 40 26.937,31.379; 41 29.477,28.839; 42 29.477,31.379; 43 32.017,28.839; 44 32.017,31.379; 45 34.557,28.839; 46 34.557,31.379; 47 37.097,28.839; 48 37.097,31.379; 49 39.637,28.839; 50 39.637,31.379; 51 42.177,28.839; 52 42.177,31.379; 53 20.592,24.511; 54 23.132,24.511; 55 25.672,24.511; 56 28.212,24.511; 57 30.752,24.511; 58 33.292,24.511; 59 35.832,24.511; 60 38.372,24.511; 61 40.912,24.511; 62 43.452,24.511; 63 57.348,33.078; 64 55.552,34.874; 65 55.552,31.282; 66 53.756,33.078; 67 53.756,29.486; 68 51.96,31.282; 69 51.96,27.69; 70 50.164,29.486; 71 58.783,46.711; 72 56.243,46.711; 73 58.783,49.251; 74 56.243,49.251; 75 58.783,51.791; 76 56.243,51.791; 77 58.783,54.331; 78 56.243,54.331; 79 58.783,56.871; 80 56.243,56.871; 81 58.783,59.411; 82 56.243,59.411; 83 58.674,64.516; 84 56.134,64.516; 85 58.674,67.056; 86 56.134,67.056; 87 58.674,69.596; 88 56.134,69.596; 89 58.674,72.136; 90 56.134,72.136; 91 58.674,74.676; 92 56.134,74.676; 93 58.674,77.216; 94 56.134,77.216; 95 58.674,79.756; 96 56.134,79.756; 97 58.674,82.296; 98 56.134,82.296; 99 58.674,84.836; 100 56.134,84.836; 101 58.674,87.376; 102 56.134,87.376; 103 58.674,89.916; 104 56.134,89.916; 105 57.192,95.746; 106 55.396,93.95; 107 55.396,97.542; 108 53.6,95.746; 109 53.6,99.338; 110 51.804,97.542; 111 51.804,101.135; 112 50.008,99.338; 113 43.434,102.616; 114 43.434,100.076; 115 40.894,102.616; 116 40.894,100.076; 117 38.354,102.616; 118 38.354,100.076; 119 35.814,102.616; 120 35.814,100.076; 121 33.274,102.616; 122 33.274,100.076; 123 30.734,102.616; 124 30.734,100.076; 125 28.194,102.616; 126 28.194,100.076; 127 25.654,102.616; 128 25.654,100.076; 129 23.114,102.616; 130 23.114,100.076; 131 20.574,102.616; 132 20.574,100.076; 133 12.208,101.133; 134 14.004,99.337; 135 10.411,99.337; 136 12.208,97.541; 137 8.615,97.541; 138 10.411,95.745; 139 6.819,95.745; 140 8.615,93.949; 141 15.494,17.78; 142 18.034,17.78; 143 15.494,15.24; 144 18.034,15.24; 145 15.494,12.7; 146 18.034,12.7; 147 15.494,10.16; 148 18.034,10.16; 149 45.974,17.78; 150 48.514,17.78; 151 45.974,15.24; 152 48.514,15.24; 153 45.974,12.7; 154 48.514,12.7; 155 45.974,10.16; 156 48.514,10.16 | hole 3.048: 17.526,94.234; 48.641,2.54
2X11 = drill 1.016 octagon: 1 -12.7,-1.27; 2 -12.7,1.27; 3 -10.16,-1.27; 4 -10.16,1.27; 5 -7.62,-1.27; 6 -7.62,1.27; 7 -5.08,-1.27; 8 -5.08,1.27; 9 -2.54,-1.27; 10 -2.54,1.27; 11 0,-1.27; 12 0,1.27; 13 2.54,-1.27; 14 2.54,1.27; 15 5.08,-1.27; 16 5.08,1.27; 17 7.62,-1.27; 18 7.62,1.27; 19 10.16,-1.27; 20 10.16,1.27; 21 12.7,-1.27; 22 12.7,1.27
1X08 = drill 1.016 long: 1 -8.89,0; 2 -6.35,0; 3 -3.81,0; 4 -1.27,0; 5 1.27,0; 6 3.81,0; 7 6.35,0; 8 8.89,0
1X04 = drill 1.016 long: 1 -3.81,0; 2 -1.27,0; 3 1.27,0; 4 3.81,0
1X2MTA = drill 1.676 long: 1 1.981,0; 2 -1.981,0
JP2 = drill 0.914 long: COM 0,0; NC 2.54,0; NO -2.54,0
2X07 = drill 1.016 octagon: 1 -7.62,-1.27; 2 -7.62,1.27; 3 -5.08,-1.27; 4 -5.08,1.27; 5 -2.54,-1.27; 6 -2.54,1.27; 7 0,-1.27; 8 0,1.27; 9 2.54,-1.27; 10 2.54,1.27; 11 5.08,-1.27; 12 5.08,1.27; 13 7.62,-1.27; 14 7.62,1.27
2X05 = drill 1.016 octagon: 1 -5.08,-1.27; 2 -5.08,1.27; 3 -2.54,-1.27; 4 -2.54,1.27; 5 0,-1.27; 6 0,1.27; 7 2.54,-1.27; 8 2.54,1.27; 9 5.08,-1.27; 10 5.08,1.27
2X06 = drill 1.016 octagon: 1 -6.35,-1.27; 2 -6.35,1.27; 3 -3.81,-1.27; 4 -3.81,1.27; 5 -1.27,-1.27; 6 -1.27,1.27; 7 1.27,-1.27; 8 1.27,1.27; 9 3.81,-1.27; 10 3.81,1.27; 11 6.35,-1.27; 12 6.35,1.27
R1206 = smd 1.6 x 1.803: 1 -1.422,0; 2 1.422,0
1X03' = drill 0.8 pad 1.4 long: 1 -2,-0.38; 2 0,-0.38; 3 2,-0.38
M9040P = drill 1.803 long: 1 0,4.699; 2 0,0; 3 0,-4.699
SOT23-BEC = smd 1 x 1.4: B -0.95,-1.1; C 0,1.1; E 0.95,-1.1
DEANS = drill 1.27 pad 3.556 long: + 0,0; - 0.737,-6.921

### Placement (x,y rotation side)
ADCX  135.4,75.08 270 top
BUZZER  46.11,134.29 270 bottom
CAM  75,18.33 0 top
CLAP_DET  97.78,127.31 90 top
D1  75,127.7 90 top
D3  16.58,43.33 180 top
D4  20.55,49.76 270 top
ESP_GPIO2  34.99,35.63 0 top
ESP_GPIO3  35.07,114.37 0 top
EYFI_MEGA  21.02,107.07 270 top
GPIO1  98.18,114.37 180 top
GPIO2  98.18,35.63 180 top
GY-87  81.98,75 90 bottom
I2C  121.51,35.63 180 top
I2C1  137.07,54.68 180 top
I2C2  137.07,49.52 180 top
INTX  121.51,114.37 180 top
J1  12.37,49.84 270 top
J2  18.64,37.14 270 top
JP1  75,140.72 0 top
JP2  10.47,58.25 0 top
JP3  75,9.59 0 top
JP4  142.07,75 90 top
JP5  57.62,127.78 90 top
JP6  60.24,137.31 0 top
JP7  93.18,142.39 0 top
JP8  92.62,11.58 0 top
JP9  92.62,16.9 0 top
JP10  92.62,22.29 0 top
LF  103.89,11.58 180 top
MTR_CTR  135.48,99.61 270 top
OLED2  103.89,16.9 0 top
OLED_1  103.89,22.29 0 top
PIR  92.94,127.31 90 top
PWM1  51.98,35.63 180 top
PWM2  50.87,114.37 180 top
R1  63.09,130.25 0 top
R2  63.09,132.78 0 top
R3  86.91,130.25 180 top
R4  86.99,125.16 180 top
R5  86.99,122.62 180 top
R6  63.09,125.16 180 top
R7  63.09,122.62 180 top
R8  86.91,132.78 0 top
R9  46.27,121.83 90 top
R10  72.46,25.87 90 top
R11  75,25.87 90 top
R12  77.54,25.87 270 top
SERVO_1  93.18,136.59 90 top
SERVO_2  98.1,136.59 90 top
SERVO_3  103.02,136.59 90 top
SH_1  103.18,127.31 90 top
SH_2  108.18,127.31 90 top
SPI1  74.05,35.63 180 top
SRP1  [1X03']  75,146.44 0 bottom
SRP2  [1X03']  145.96,75 270 bottom
SRP3  [1X03']  75,3.48 180 bottom
SRP4  [1X03']  3.8,75 90 bottom
SW4  47.77,15.63 90 top
T1  45.15,126.2 90 top
U$1  47.77,24.91 90 top
UART  74.05,114.37 180 top
ULTRASONIC  60.39,142.31 0 top

### Tracks (layer width: path | path; a pad name or v marks a point on that pad's centre or on a via)
+3.3V
  Top 0.305: 73.75,15.86 84.03,15.86 85.15,16.97 CAM.17 | 73.75,15.86 69.36,15.86 68.66,16.55 68.66,17.53 67.96,18.23 66.85,18.23 65.73,17.11 64.89,17.11 CAM.1 | EYFI_MEGA.53 45.61,86.4 45.61,84.03 EYFI_MEGA.54 45.61,83.89 45.61,81.51 EYFI_MEGA.55 45.61,81.38 45.61,78.86 EYFI_MEGA.56 45.61,78.72 45.61,76.35 EYFI_MEGA.57 45.61,76.21 45.61,73.83 EYFI_MEGA.58 45.61,73.69 45.61,71.32 EYFI_MEGA.59 45.61,71.18 45.61,68.8 EYFI_MEGA.60 45.61,68.66 45.61,66.29 EYFI_MEGA.61 45.61,66.15 45.61,63.63 EYFI_MEGA.62 46.57,62.58 55.65,62.58 58.5,59.74 58.5,42.98 53.27,37.75 53.27,33.64 54.06,32.85 58.41,32.85 71.13,20.13 71.13,18.95 71.82,18.27 73.07,18.27 73.75,17.59 73.75,15.86
+5V  (via drill 0.35, 0.35 pad 0.9)  (1 unrouted)
  Top 0.813: EYFI_MEGA.72 67.68,50.78 67.68,48.41 EYFI_MEGA.71 67.82,47.99 67.82,37.23 SPI1.11 67.68,36.81 67.68,34.44 SPI1.12 68.1,34.3 69.5,32.9 83.89,32.9 85.15,34.16 GPIO2.22 85.43,34.44 85.43,36.81 GPIO2.21 85.57,37.23 85.57,47.99 EYFI_MEGA.83 85.57,48.41 85.57,50.92 EYFI_MEGA.84 | JP3.NO 72.46,10.94 73.32,11.8 89.9,11.8 90.04,11.66 JP8.NO 90.18,12.08 90.18,16.83 JP9.NO | EYFI_MEGA.51 EYFI_MEGA.52 56.79,64.89 60.29,61.39 60.29,40.09 57.1,36.9 PWM1.1 | v63.91,34.44 57.07,34.44 PWM1.2 | ADCX.2 136.56,86.54 134.18,86.54 ADCX.1 133.9,86.82 132.78,87.94 | 132.78,87.94 132.78,92.69 134.18,94.09 134.18,94.51 MTR_CTR.11 | EYFI_MEGA.133 122.17,94.79 120.49,93.11 EYFI_MEGA.134 120.77,92.83 121.19,92.41 121.19,86.96 EYFI_MEGA.132 121.19,86.54 123.56,86.54 EYFI_MEGA.131 123.98,86.68 124.96,87.66 132.51,87.66 132.78,87.94 | JP4.NO 141.93,72.4 141.93,57.55 140.88,56.51 I2C1.1 I2C2.1 140.88,46.7 138.53,44.35 125.1,44.35 | I2C.2 125.38,34.44 125.38,36.81 I2C.1 125.1,37.23 125.1,44.35 | EYFI_MEGA.112 120.49,56.93 122.03,55.39 EYFI_MEGA.111 122.31,54.97 125.1,52.18 125.1,44.35 | EYFI_MEGA.22 85.57,99.26 85.57,101.63 EYFI_MEGA.21 85.57,102.05 85.57,112.81 GPIO1.22 85.43,113.23 85.43,115.6 GPIO1.21 85.57,116.02 v88.64,119.09 | T1.C 43.94,126.28 43.94,131.66 45.98,133.71 | JP6.NO 55.7,137.31 55.7,137.32 49.59,137.32 45.98,133.71 | UART.12 67.68,113.23 67.68,115.6 UART.11 | UART.12 67.82,112.81 67.82,101.91 EYFI_MEGA.33 67.68,101.49 67.68,99.12 EYFI_MEGA.34 67.7,97.95 78.59,87.06 78.59,68.18 80.62,66.15 81.93,66.15 GY-87.1 | PWM2.2 57.35,113.09 67.27,113.09 UART.12
  Top 0.813: JP1.NO 72.57,140.61 72.57,138.94 74.22,137.29 74.22,125.38 64.59,115.74 57.35,115.74 PWM2.1 57.07,116.02 57.07,122.62 45.98,133.71 | 93.95,123.42 103.17,123.42 109.18,117.42 113.15,117.42 114.13,116.43 114.13,112.62 116.75,110 122.23,110 INTX.2 125.38,113.23 125.38,115.6 INTX.1 124.96,115.74 | PIR.3 CLAP_DET.3 SH_1.3 SH_2.3
  Top 1.27: MTR_CTR.11 MTR_CTR.12
  Bottom 0.813: GY-87.1 82.07,66.01 82.07,54.41 85.43,51.06 EYFI_MEGA.84 | 57.06,30.68 58.15,30.68 59.98,28.85 59.98,18.95 69.22,9.71 72.43,9.71 JP3.NO | 56.93,34.3 PWM1.2 | PWM1.1 57.07,36.81 57.07,34.72 PWM1.2 | v63.91,34.44 67.68,34.44 SPI1.12 | INTX.2 125.24,113.09 125.24,98 122.17,94.93 EYFI_MEGA.133 | EYFI_MEGA.132 121.08,86.49 118.78,84.19 118.78,58.64 EYFI_MEGA.112 | v88.64,119.09 89.48,119.93 89.48,127.76 91.57,129.85 PIR.3 | JP7.NO 90.64,142.44 89.68,143.4 74.63,143.4 72.57,141.34 72.57,140.75 JP1.NO | PWM2.2 57.21,113.23 57.21,115.6 PWM2.1 | GPIO1.21 85.43,115.74 82.35,115.74 80.96,117.14 69.22,117.14 67.82,115.74 UART.11 | PWM1.2 57.06,30.68 | 57.06,30.68 30.98,30.68 28.17,33.49 28.17,49.92 23.41,54.68 10.23,54.68 7.93,56.98 JP2.NO
+12V
  Top 1.27: EYFI_MEGA.63 EYFI_MEGA.65 EYFI_MEGA.66 EYFI_MEGA.64 | EYFI_MEGA.63 | EYFI_MEGA.63 EYFI_MEGA.64 | EYFI_MEGA.64 | EYFI_MEGA.63 43.07,38.69 43.07,28.49 | 20.54,51.82 D4.C 21.02,51.81 | 18.64,43.32 D3.C | 26.42,43.33 26.5,43.25
  Top 1.778: SW4.1 43.07,28.49 29.76,28.49 26.5,31.74 26.5,43.25 26.5,46.33 21.02,51.81 | J1.2 20.54,51.82 | J2.2 18.64,43.32 | D3.C 26.42,43.33
+VE_BTRY
  Top 1.778: SW4.3 SW4.2
  Bottom 2.54: U$1.+ SW4.2
ADC0  (via drill 0.35)
  Top 0.305: v126.92,119.65 121.47,119.65 112.25,128.87 112.25,131.48 105.91,137.81 75.51,137.81 73.83,139.49 73.83,141.94 74.95,143.06 74.95,145.98 SRP1.2 | EYFI_MEGA.130 122.27,82.77 132.92,82.77 134.04,83.89 ADCX.3
  Bottom 0.305: v126.92,119.65 138.51,108.06 138.51,90.35 135.44,87.28 135.44,85.29 134.13,83.98 ADCX.3
ADC1
  Top 0.305: EYFI_MEGA.129 132.27,83.95 133.54,85.23 135.76,85.23 136.67,84.31 ADCX.4
  Bottom 0.305: ADCX.4 139.2,83.97 144.12,79.05 144.12,76.33 145.44,75.01 SRP2.2
ADC2
  Bottom 0.305: 122.31,80.12 122.31,80.18 121.1,81.38 EYFI_MEGA.128 | 122.31,80.12 122.31,57.35 112.25,47.29 112.25,18.79 106.52,13.06 106.52,10.41 105.12,9.01 88.33,9.01 85.66,6.34 76.75,6.34 75,4.59 SRP3.2 | 122.31,80.12 127.69,80.12 128.95,81.38 134.04,81.38 ADCX.5
ADC3  (via drill 0.35)
  Top 0.305: v51.76,76.35 49.38,76.35 47.29,78.44 47.29,87.12 46.43,87.98 44.5,87.98 31.53,75.01 3.7,75.01 3.69,75 SRP4.2 | v74.9,76.35 v57.67,76.35 | v92.54,80.06 92.6,80.12 122.31,80.12 123.56,81.38 EYFI_MEGA.127
  Bottom 0.305: v57.67,76.35 v51.76,76.35 | v74.9,76.35 78.61,80.06 v92.54,80.06 | ADCX.6 136.56,81.51 136.12,81.51 135,82.63 124.82,82.63 123.7,81.51 EYFI_MEGA.127
ADC4
  Top 0.305: EYFI_MEGA.126 121.95,78.87 122.06,79.04 123.15,80.12 132.92,80.12 133.42,79.62 133.51,79.51 ADCX.7
ADC5
  Bottom 0.305: EYFI_MEGA.125 123.7,79 129.01,79 130.13,80.12 135.44,80.12 136.56,79 ADCX.8
ADC6
  Top 0.305: EYFI_MEGA.124 121.1,76.35 122.35,77.6 132.88,77.6 ADCX.9
ADC7
  Bottom 0.305: EYFI_MEGA.123 127.67,76.33 128.94,77.6 135.44,77.6 136.56,76.49 ADCX.10
ADC8
  Top 0.305: EYFI_MEGA.122 121.13,73.8 122.41,75.09 132.85,75.09 ADCX.11
ADC9
  Top 0.305: ADCX.12 135.44,72.57 133.62,72.57 132.51,73.69 123.7,73.69 EYFI_MEGA.121
ADC10
  Top 0.305: EYFI_MEGA.120 121.1,71.26 122.27,72.43 132.69,72.43 133.85,71.27 ADCX.13
ADC11
  Top 0.305: EYFI_MEGA.119 123.7,71.18 132.51,71.18 133.62,70.06 135.44,70.06 136.67,71.29 ADCX.14
ADC12
  Top 0.305: EYFI_MEGA.118 122.31,69.92 132.55,69.92 133.74,68.73 ADCX.15
  Bottom 0.305: ADCX.15 134.15,68.74 134.47,68.74 135.66,67.54 144.29,67.54 148.15,71.4 148.15,77.7 139.66,86.19 139.66,108.87 121.89,126.64 110.38,126.64 109.68,127.34 108.18,127.34 SH_2.2
ADC13
  Top 0.305: EYFI_MEGA.117 123.7,68.66 132.27,68.66 133.38,67.54 135.44,67.54 136.56,68.66 ADCX.16
  Bottom 0.305: SH_1.2 103.38,127.31 104.61,126.08 121.61,126.08 139.07,108.62 139.07,87 137.29,85.23 136.22,85.23 135.44,84.45 135.44,83.47 136.28,82.63 137.25,82.63 137.95,81.93 137.95,69.98 136.7,68.73 ADCX.16
ADC14  (via drill 0.35)
  Top 0.305: EYFI_MEGA.116 121.12,66.15 121.18,66.15 122.43,67.4 131.81,67.4 133.03,66.19 ADCX.17 | v120.35,118.81 113.09,126.08 101.31,126.08 100.08,127.31 CLAP_DET.2
  Bottom 0.305: v120.35,118.81 126.92,118.81 137.95,107.78 137.95,101.63 137.12,100.79 136.28,100.79 135.44,99.95 135.44,99.12 134.6,98.28 132.81,98.28 122.31,87.78 122.31,83.47 121.47,82.63 120.63,82.63 119.85,81.85 119.85,67.4 121.08,66.17 EYFI_MEGA.116
ADC15
  Top 0.305: PIR.2 93.33,127.31 94.61,128.59 111.69,128.59 121.63,118.65 124.56,118.65 135.58,107.64 135.58,106.66 136.28,105.96 137.25,105.96 137.95,105.26 137.95,67.54 136.7,66.29 ADCX.18
  Bottom 0.305: EYFI_MEGA.115 123.66,66.21 123.69,66.21 124.97,67.48 134.67,67.48 135.96,66.19 ADCX.18
ESP_D5
  Top 0.305: EYFI_MEGA.143 36.25,91.57 36.25,111.41 35.13,112.53 35.13,114.48 36.25,115.6 ESP_GPIO3.6
ESP_D12
  Bottom 0.305: EYFI_MEGA.149 38.91,61.09 40.02,59.98 40.02,38.07 38.91,36.95 ESP_GPIO2.8
ESP_D13
  Top 0.305: EYFI_MEGA.141 38.77,91.57 38.77,111.55 37.65,112.67 37.65,114.48 38.77,115.6 ESP_GPIO3.8
ESP_D14
  Top 0.305: EYFI_MEGA.150 38.91,58.46 38.91,38.73 40.02,37.61 40.02,35.55 38.91,34.44 ESP_GPIO2.7
ESP_D19
  Bottom 0.305: EYFI_MEGA.146 33.74,89.06 33.74,89.9 34.99,91.15 34.99,111.97 33.88,113.09 ESP_GPIO3.3
ESP_D21
  Top 0.305: EYFI_MEGA.145 33.6,91.57 33.6,111.55 32.62,112.53 32.62,114.48 33.74,115.6 ESP_GPIO3.4
ESP_D22
  Top 0.305: EYFI_MEGA.148 31.08,89.06 31.08,89.9 29.97,91.01 29.97,111.83 31.22,113.09 ESP_GPIO3.1
ESP_D23
  Bottom 0.305: EYFI_MEGA.147 31.22,91.57 31.22,111.27 32.48,112.53 32.48,114.48 31.36,115.6 ESP_GPIO3.2
ESP_D25
  Top 0.305: EYFI_MEGA.152 36.39,58.46 36.39,38.73 37.51,37.61 37.51,35.55 36.39,34.44 ESP_GPIO2.5
ESP_D26
  Bottom 0.305: EYFI_MEGA.151 36.31,61.09 37.51,59.9 37.51,38.07 36.39,36.95 ESP_GPIO2.6
ESP_D34
  Top 0.305: EYFI_MEGA.154 33.6,58.46 33.6,38.73 32.48,37.61 32.48,35.55 33.6,34.44 ESP_GPIO2.3
ESP_D35
  Bottom 0.305: EYFI_MEGA.153 33.68,61.09 32.48,59.9 32.48,38.07 33.6,36.95 ESP_GPIO2.4
ESP_RX2
  Top 0.305: EYFI_MEGA.142 38.91,89.06 38.91,89.9 40.02,91.01 40.02,111.97 38.91,113.09 ESP_GPIO3.7
ESP_TX2
  Top 0.305: EYFI_MEGA.144 36.39,89.06 36.39,90.04 37.51,91.15 37.51,111.97 36.39,113.09 ESP_GPIO3.5
ESP_VN
  Bottom 0.305: EYFI_MEGA.155 31.08,61.09 29.97,59.98 29.97,38.07 31.08,36.95 ESP_GPIO2.2
ESP_VP
  Top 0.305: EYFI_MEGA.156 31.08,58.46 31.08,38.73 29.97,37.61 29.97,35.55 31.08,34.44 ESP_GPIO2.1
GND  (via drill 0.35)
  Top 1.27: U$1.- 54.68,25.67 54.68,28.49 | U$1.- 54.7,23.1 | U$1.- 59.23,25.65
  other vias: 76.19,30.23 76.27,22.29 60.16,96.91 71.75,86.11 96.91,81.27 64.52,79.29 59.12,67.38 55.47,74.84 56.58,57.06 59.12,122.15 81.43,30.23 94.53,43.01 105.56,43.01 96.75,60.71 85.79,60.55 86.35,78.25 83.65,87.3 85.79,94.37 91.51,81.19 86.35,13.4 82.3,13.33 66.82,14.28 62.78,14.12 58.65,20.63 62.22,20.63 67.22,26.26 70.79,22.61 62.62,39.2 63.41,38.41 67.46,75.4 107.54,79.05 107.54,81.27 130.48,104.45 126.99,104.45 118.66,104.45 114.85,102.86 144.69,69.84 140.01,69.68 140.01,66.03 146.91,68.49 110,110.32 110.08,104.29 115.48,114.37 121.59,124.29 124.21,121.51 125.4,93.65 123.26,91.51 129.61,91.43 127.23,89.29 119.69,91.19 119.69,88.1 91.51,78.97 83.65,89.13 83.65,90.8 81.03,90.72 80.79,89.21 80.79,87.3 77.46,91.03 76.27,92.07 74.52,89.13 60.16,100.08 57.22,100.08 57.3,96.91 46.98,100 49.92,100 46.98,104.05 49.92,104.05 52.3,104.05 52.3,100 77.86,122.55
  pour Top (isolate 0.254): 75,149.93 arc-90 149.93,75 arc-90 75,0.07 arc-90 0.07,75 arc-90
  pour Bottom (isolate 0.254, hatched): 75,149.93 arc-90 149.93,75 arc-90 75,0.07 arc-90 0.07,75 arc-90
INT4
  Top 0.305: EYFI_MEGA.135 120.49,96.74 133.9,96.74 134.18,97.02 MTR_CTR.9
  Bottom 0.305: INTX.3 122.86,115.64 123.98,114.52 123.98,100.23 120.49,96.74 EYFI_MEGA.135
INT5
  Top 0.305: EYFI_MEGA.136 118.67,94.93 120.49,94.93 121.61,96.04 133.48,96.04 133.76,95.76 135.44,95.76 136.7,97.02 MTR_CTR.10
  Bottom 0.305: INTX.4 122.73,113.09 122.73,100.79 118.67,96.74 118.67,94.93 EYFI_MEGA.136
INT6
  Top 0.305: EYFI_MEGA.137 118.67,98.56 120.07,98.56 121.05,99.54 134.18,99.54 MTR_CTR.7
  Bottom 0.305: INTX.5 120.37,115.52 120.41,115.5 121.47,114.44 121.47,101.35 118.67,98.56 EYFI_MEGA.137
INT7
  Top 0.305: MTR_CTR.8 136.7,99.54 135.86,99.54 134.6,98.28 120.63,98.28 120.21,97.86 119.65,97.86 118.54,96.74 116.86,96.74 EYFI_MEGA.138
  Bottom 0.305: EYFI_MEGA.138 116.86,96.74 116.86,98.56 120.21,101.91 120.21,113.09 INTX.6
MISO
  Bottom 0.305: EYFI_MEGA.80 77.88,50.78 77.88,49.94 76.63,48.69 76.63,38.07 77.74,36.95 SPI1.3
MOSI
  Top 0.305: EYFI_MEGA.78 75.23,50.78 75.23,49.8 74.11,48.69 74.11,38.07 75.23,36.95 SPI1.5
N$2
  Top 0.305: R1.2 64.61,130.27 67.27,130.27 D1.7
N$3
  Top 0.305: T1.E 46.17,127.21 46.17,130.41 BUZZER.+
N$4
  Top 0.305: D1.6 R2.2
N$5
  Top 0.305: 46.24,123.28 R9.2 46.25,123.26 T1.B
N$6
  Top 0.305: R3.2 85.43,130.27 82.63,130.27 D1.4
N$7
  Top 0.305: R4.2 85.43,125.24 82.63,125.24 D1.2
N$8
  Top 0.305: R5.2 85.43,122.59 82.63,122.59 D1.1
N$9
  Top 0.305: R6.1 64.61,125.24 67.27,125.24 D1.9
N$10
  Top 0.305: R7.1 64.61,122.59 67.27,122.59 D1.10
N$11
  Top 0.305: D1.5 R8.1
N$12
  Top 0.813: JP6.COM 60.28,137.4 60.28,138.37 56.65,142 56.65,142.28 ULTRASONIC.1
N$13
  Top 0.305: D1.8 67.27,127.76 57.63,127.76 JP5.COM
  Bottom 0.305: D1.3 82.49,127.76 67.4,127.76 D1.8
N$14
  Top 0.813: 97.86,19.07 94.65,19.07 93.81,18.23 93.81,18.09 92.69,16.97 JP9.COM | 97.86,19.07 99.95,16.97 OLED2.1 | 97.86,19.07 99.95,21.16 99.95,22.28 OLED_1.1
N$15
  Bottom 0.305: JP10.COM 92.69,22.42 92.97,22.42 94.79,24.24 100.79,24.24 102.61,22.42 OLED_1.2 102.61,22.14 102.61,16.97 OLED2.2
N$16
  Top 0.305: JP8.COM 92.69,11.66 94.65,13.62 105.68,13.62 107.64,11.66 LF.1
N$17
  Top 0.305: R11.2 75.09,27.31 77.46,27.31 R12.1
N$18
  Top 0.305: JP4.COM 143.17,75 145.17,77 SRP2.1
N$19
  Top 0.813: SRP4.1 3.46,72.96 3.46,68.32 10.47,61.31 JP2.COM
N$20
  Top 0.305: JP3.COM 75,7.71 73,5.71 SRP3.1
N$21
  Top 0.305: JP1.COM 75,141.22 76.9,143.12 76.9,145.98 SRP1.1
N$23
  Top 0.813: JP7.COM 93.25,142.34 93.25,139.21 SERVO_1.3 93.53,139.21 98,139.21 SERVO_2.3 98.42,139.21 102.89,139.21 SERVO_3.3
OC0A  (via drill 0.35)
  Top 0.305: v49.48,39.08 50.7,37.86 50.7,35.63 51.9,34.44 PWM1.6
  Bottom 0.305: v49.48,39.08 47.43,41.14 47.43,66.71 49.8,69.08 49.8,69.92 EYFI_MEGA.47
OC0B
  Bottom 0.305: EYFI_MEGA.46 52.32,72.43 52.32,71.6 51.2,70.48 51.2,57.91 51.76,57.35 51.76,56.23 49.24,53.71 49.24,40.36 50.24,39.36 50.24,37.67 49.52,36.95 PWM1.7
OC1A
  Bottom 0.305: EYFI_MEGA.44 52.32,74.95 51.48,74.95 50.36,73.83 49.38,73.83 48.69,74.53 48.69,107.92 53.43,112.67 53.43,114.48 54.55,115.6 PWM2.3
OC1B
  Top 0.305: CAM.7 72.43,17.11 71.6,17.11 70.34,18.37 69.36,18.37 68.66,19.07 68.66,21.63 58.07,32.23 51.59,32.23 49.52,34.3 PWM1.8
  Bottom 0.305: EYFI_MEGA.45 49.8,72.43 49.8,71.6 46.87,68.66 46.87,38.63 48.27,37.23 48.27,35.55 49.38,34.44 PWM1.8
OC2A
  Bottom 0.305: EYFI_MEGA.43 49.94,75.09 49.94,75.93 51.2,77.18 51.2,109.59 54.69,113.09 PWM2.4
OC2B
  Top 0.305: R10.2 72.43,27.31 72.43,27.87 61.45,38.86 61.45,62.36 53.65,70.16 53.65,76.35 EYFI_MEGA.42 | 52.46,77.46 EYFI_MEGA.42 | PWM2.5 52.04,115.6 51.34,115.6 50.08,114.34 46.59,114.34 45.89,113.65 45.89,99.12 48.69,96.32 48.69,79.56 49.38,78.86 51.06,78.86 52.32,77.6 EYFI_MEGA.42
OC3A  (via drill 0.35)
  Top 0.305: PWM2.9 46.98,115.72 46.98,119.69 46.28,120.39 R9.1 | v49.24,111.69 50.12,111.69 53.57,108.23 53.57,84.73 52.46,83.61 52.46,82.77 EYFI_MEGA.38
  Bottom 0.305: v49.24,111.69 48.27,112.67 48.27,113.79 47.06,114.99 PWM2.9
OC4A
  Top 0.305: 53.09,109.66 49.66,113.09 PWM2.8 | 53.09,109.66 54.13,108.62 54.13,82.63 52.88,81.38 51.9,81.38 50.78,80.26 49.94,80.26 EYFI_MEGA.39 | SERVO_1.2 92.74,137.03 76.8,137.03 75.22,135.45 75.22,124.96 64.6,114.34 56.79,114.34 55.95,113.51 55.95,112.53 53.09,109.66
OC4B
  Bottom 0.305: EYFI_MEGA.40 52.74,80.13 58.89,86.27 58.89,120.19 | PWM2.7 49.66,115.74 51.18,117.26 55.95,117.26 58.89,120.19 | 58.89,120.19 65.12,126.42 86.18,126.42 92.46,132.71 94.53,132.71 95.56,133.74 95.56,135.96 96.19,136.59 SERVO_2.2
OC4C  (via drill 0.35)
  Top 0.305: v47.85,96.04 47.85,79.56 49.8,77.6 EYFI_MEGA.41 | SERVO_3.2 101.74,136.59 100.45,135.3 v89.6,135.3
  Bottom 0.305: v47.85,96.04 48.09,96.28 48.09,109.13 52.04,113.09 PWM2.6 51.62,112.81 50.08,114.34 49.1,114.34 48.41,115.04 48.41,116.16 50.22,117.97 52.73,117.97 63.63,128.87 68.24,128.87 74.67,135.3 v89.6,135.3
OC5A  (via drill 0.35)
  Top 0.305: v83.33,96.32 110.57,96.32 116.3,102.05 134.18,102.05 MTR_CTR.5
  Bottom 0.305: PWM1.5 52.04,36.81 53.16,35.69 54.97,35.69 55.81,36.53 55.81,37.53 58.26,39.98 58.26,63.28 52.46,69.08 52.46,69.92 EYFI_MEGA.48 52.6,69.92 79,96.32 v83.33,96.32
OC5B  (via drill 0.35)
  Top 0.305: PWM1.4 54.55,34.44 55.81,35.69 55.81,39.35 59.13,42.68 59.13,60.07 55.95,63.25 49.39,63.25 48.53,64.12 48.53,66.09 EYFI_MEGA.49 51.08,68.65 v54.04,68.65 | v83.33,95.34 113.65,95.34 119.09,100.79 134.6,100.79 135.86,102.05 136.7,102.05 MTR_CTR.6
  Bottom 0.305: v54.04,68.65 56.64,68.65 v83.33,95.34
OC5C
  Bottom 0.305: EYFI_MEGA.50 52.46,67.4 52.46,66.57 55.39,63.63 55.39,52.74 54.69,52.04 54.69,50.78 55.39,50.08 55.39,38.61 54.52,37.74 PWM1.3
PA0
  Top 0.305: EYFI_MEGA.102 108.34,50.92 108.34,50.08 107.22,48.96 107.22,38.07 108.34,36.95 GPIO2.3
  Bottom 0.305: CAM.16 82.63,19.63 95.62,32.62 103.31,32.62 104.57,33.88 104.57,34.85 105.4,35.69 107.22,35.69 108.34,36.81 GPIO2.3
PA1
  Top 0.305: EYFI_MEGA.101 108.48,48.27 108.48,38.49 109.59,37.37 109.59,35.69 108.34,34.44 GPIO2.4
  Bottom 0.305: CAM.15 82.63,17.11 82.63,17.95 83.89,19.21 83.89,20.05 95.9,32.06 106.1,32.06 108.34,34.3 GPIO2.4
PA2
  Bottom 0.305: EYFI_MEGA.100 105.8,50.93 104.57,49.7 104.57,38.07 105.68,36.95 GPIO2.5 105.26,37.23 103.73,35.69 102.89,35.69 102.05,34.85 102.05,34.02 101.21,33.18 94.51,33.18 80.96,19.63 80.12,19.63 CAM.14
PA3
  Top 0.305: EYFI_MEGA.99 106.52,47.57 106.52,37.93 107.08,37.37 107.08,35.69 105.82,34.44 GPIO2.6 105.68,34.3 102.89,31.5 95.34,31.5 83.89,20.05 83.89,19.21 83.05,18.37 82.21,18.37 80.96,17.11 80.12,17.11 CAM.13
PA4
  Top 0.305: EYFI_MEGA.98 103.31,50.92 103.31,50.08 102.05,48.82 102.05,38.07 103.17,36.95 GPIO2.7
  Bottom 0.305: GPIO2.7 102.05,35.69 92.69,35.69 91.85,34.85 91.85,33.88 77.6,19.63 CAM.12
PA5
  Top 0.305: EYFI_MEGA.97 103.45,48.27 103.45,38.49 104.43,37.51 104.43,35.55 103.31,34.44 GPIO2.8 103.17,34.3 100.93,32.06 93.39,32.06 81.38,20.05 81.38,19.21 80.54,18.37 79.7,18.37 78.44,17.11 77.6,17.11 CAM.11
PA6
  Top 0.305: EYFI_MEGA.96 100.65,50.92 100.65,49.94 99.54,48.82 99.54,38.07 100.65,36.95 GPIO2.9 100.65,36.81 99.54,35.69 99.54,34.02 98.7,33.18 89.34,33.18 75.79,19.63 75.09,19.63 CAM.10
PA7
  Top 0.305: EYFI_MEGA.95 100.79,48.27 100.79,38.49 101.91,37.37 101.91,35.55 GPIO2.10 98.98,32.62 91.43,32.62 78.86,20.05 78.86,19.21 78.02,18.37 77.18,18.37 75.93,17.11 75.09,17.11 CAM.9
PB1
  Top 0.305: SPI1.8 73.97,35.55 73.97,37.37 72.85,38.49 72.85,48.27 EYFI_MEGA.75
PB2
  Bottom 0.305: EYFI_MEGA.77 75.86,47.78 75.86,39.12 74.11,37.37 74.11,35.55 75.23,34.44 SPI1.6
PB3
  Top 0.305: EYFI_MEGA.79 77.88,48.27 77.88,38.63 76.63,37.37 76.63,35.55 77.74,34.44 SPI1.4
PC0  (via drill 0.35)
  Top 0.305: R1.1 61.45,130.25 60.18,131.51 60.18,133.74 60.83,134.39 62.48,134.39 71.88,143.79 71.88,147.31 72.49,147.93 78.01,147.93 85.61,140.33 v90.46,140.33 | v99.77,121.59 102.63,118.74 106.46,118.74 v108.06,117.14 | EYFI_MEGA.6 105.82,99.26 105.82,100.09 104.57,101.35 104.57,111.83 105.82,113.09 GPIO1.6
  Bottom 0.305: v90.46,140.33 99.4,140.33 100.6,139.13 100.6,132.15 99.77,131.32 v99.77,121.59 | v108.06,117.14 107.08,116.16 107.08,114.48 105.82,113.23 GPIO1.6
PC1  (via drill 0.35)
  Top 0.305: v72.15,125.66 68.94,128.87 63.57,128.87 63.06,129.39 63.06,131.49 61.76,132.78 R2.1 | v94.15,118.26 96.18,118.26 97.58,116.86 104.57,116.86 105.68,115.74 GPIO1.5 105.82,115.6 107.08,114.34 107.08,112.67 105.96,111.55 105.96,101.77 EYFI_MEGA.5
  Bottom 0.305: v72.15,125.66 79.56,118.26 v94.15,118.26
PC2
  Top 0.305: R3.1 88.22,130.13 88.22,127.34 87.1,126.22 87.1,121.11 88.28,119.93 95.34,119.93 97.86,117.42 105.68,117.42 107.08,116.02 107.08,115.18 108.34,113.93 GPIO1.4 108.34,113.09 107.22,111.97 107.22,101.21 108.34,100.09 108.34,99.26 EYFI_MEGA.4
PC3
  Top 0.305: 88.5,125.1 R4.1 89.04,125.16 89.76,124.44 89.76,121.28 90.55,120.49 95.58,120.49 98.09,117.98 106.1,117.98 108.34,115.74 GPIO1.3 108.48,115.6 109.59,114.48 109.59,112.67 108.48,111.55 108.48,101.77 EYFI_MEGA.3
PC4  (via drill 0.35)
  Top 0.305: v88.36,121.05 88.36,122.59 R5.1 | v79.98,121 79.98,117.84 81.93,115.88 81.93,86.4 89.34,79 89.34,50.36 88.08,49.1 EYFI_MEGA.85 88.08,48.27 89.2,47.15 89.2,35.52 88.04,34.36 GPIO2.20
  Bottom 0.305: v88.36,121.05 80.03,121.05 v79.98,121
PC5  (via drill 0.35)
  Top 0.305: v62.93,116.86 62.93,123.84 61.68,125.1 R6.2 | v62.86,95.79 77.67,80.97 77.67,61.47 88.08,51.06 EYFI_MEGA.86 87.94,50.92 86.82,49.8 86.82,47.99 87.94,46.87 87.94,36.95 GPIO2.19
  Bottom 0.305: v62.93,116.86 62.86,116.78 v62.86,95.79
PC6  (via drill 0.35)
  Top 0.305: v61.68,116.86 61.68,122.59 R7.2 | v61.68,89.06 61.68,87.31 71.81,77.18 75.58,77.18 76.95,75.81 76.95,61.07 v85.71,52.32 | GPIO2.18 90.6,34.44 90.6,34.8 91.85,36.05 91.85,47.15 90.73,48.27 EYFI_MEGA.87
  Bottom 0.305: v61.68,89.06 v61.68,116.86 | v85.71,52.32 85.85,52.32 86.82,51.34 86.82,50.5 87.66,49.66 89.34,49.66 90.6,48.41 EYFI_MEGA.87
PC7
  Top 0.305: R8.2 88.22,132.78 88.22,132.51 86.82,131.11 86.82,129.29 83.89,126.36 81.51,126.36 80.82,125.66 80.82,117.84 82.49,116.16 82.49,86.68 90.6,78.58 90.6,51.06 EYFI_MEGA.88 90.6,50.78 89.34,49.52 89.34,47.99 90.46,46.87 90.46,36.95 GPIO2.17
PD0
  Bottom 0.305: EYFI_MEGA.107 118.67,51.62 118.67,37.65 118.95,37.37 118.95,35.69 120.21,34.44 I2C.6
PD1
  Top 0.305: EYFI_MEGA.109 120.49,53.43 120.49,48.69 123.98,45.19 123.98,35.55 123.82,35.39 I2C.4
PD4
  Top 0.305: EYFI_MEGA.12 98.14,99.26 98.14,100.09 97.02,101.21 97.02,111.97 98.14,113.09 GPIO1.12
  Bottom 0.305: GPIO1.12 98.18,112.71 99.06,111.83 111.27,111.83 116.86,117.41 125.24,117.41 134.18,108.48 134.18,107.36 MTR_CTR.1
PD5
  Top 0.305: EYFI_MEGA.11 98.28,101.77 98.28,111.41 99.4,112.53 99.4,114.48 98.28,115.6 GPIO1.11
  Bottom 0.305: GPIO1.11 98.18,116.27 99.88,117.98 126.08,117.98 136.69,107.36 136.7,107.36 MTR_CTR.2
PD6
  Top 0.305: EYFI_MEGA.10 100.65,99.26 100.65,100.09 99.54,101.21 99.54,111.83 100.79,113.09 GPIO1.10
  Bottom 0.305: MTR_CTR.3 134.18,104.57 133.62,104.57 122.73,93.67 121.47,93.67 120.91,94.23 119.65,94.23 119.09,93.67 106.24,93.67 100.79,99.12 EYFI_MEGA.10
PD7
  Top 0.305: GPIO1.9 100.79,115.6 101.91,114.48 101.91,112.53 100.79,111.41 100.79,101.77 EYFI_MEGA.9 100.79,101.63 102.05,100.38 102.05,98.7 102.75,98 111.41,98 116.86,103.45 134.74,103.45 135.86,104.57 136.7,104.57 MTR_CTR.4
PE2
  Top 0.305: EYFI_MEGA.20 88.08,99.95 86.82,101.21 86.82,111.97 87.94,113.09 GPIO1.20
PG0
  Top 0.305: EYFI_MEGA.8 103.31,99.26 103.31,99.95 102.05,101.21 102.05,111.83 103.31,113.09 GPIO1.8
PG1
  Top 0.305: EYFI_MEGA.7 103.45,101.77 103.45,111.55 104.43,112.53 104.43,114.48 103.31,115.6 GPIO1.7
PG2
  Top 0.305: EYFI_MEGA.94 98.14,50.92 98.14,49.94 97.02,48.82 97.02,38.07 98.14,36.95 GPIO2.11
  Bottom 0.305: ULTRASONIC.2 59.12,140.89 59.87,140.15 66.29,140.15 68.63,137.81 99.4,137.81 100.03,137.18 100.03,132.49 99.21,131.67 96.27,131.67 95.48,130.88 95.48,117.27 94.37,116.16 94.37,54.81 EYFI_MEGA.94
PH2
  Top 0.305: EYFI_MEGA.19 88.08,111.41 89.2,112.53 89.2,114.48 88.08,115.6 GPIO1.19
PH7
  Bottom 0.305: EYFI_MEGA.18 90.6,99.26 90.6,100.09 89.34,101.35 89.34,111.97 90.46,113.09 GPIO1.18
PJ2
  Top 0.305: EYFI_MEGA.89 93.25,48.27 93.25,38.49 94.37,37.37 94.37,35.69 93.11,34.44 GPIO2.16
PJ3
  Bottom 0.305: EYFI_MEGA.90 93.09,50.93 91.99,49.84 91.99,37.93 92.97,36.95 GPIO2.15
PJ4
  Top 0.305: EYFI_MEGA.91 95.76,48.27 95.76,38.49 96.88,37.37 96.88,35.55 95.76,34.44 GPIO2.14
PJ5
  Bottom 0.305: EYFI_MEGA.92 95.79,50.93 96.88,49.84 96.88,38.07 95.76,36.95 GPIO2.13
PJ6
  Top 0.305: EYFI_MEGA.93 98.28,48.27 98.28,38.49 99.4,37.37 99.4,36.39 98.28,35.27 98.28,34.44 GPIO2.12
  Bottom 0.305: ULTRASONIC.3 61.66,143.36 62.54,144.24 96.38,144.24 100.22,140.41 104.29,140.41 104.98,139.71 104.98,133.51 103.94,132.47 101.75,132.47 100.53,131.25 100.53,119.9 96.88,116.26 96.88,98.23 99.54,95.58 99.54,49.66 98.28,48.41 EYFI_MEGA.93
PL0
  Top 0.305: GPIO1.17 91.85,114.34 91.85,112.67 90.73,111.55 90.73,101.77 EYFI_MEGA.17
PL1
  Bottom 0.305: EYFI_MEGA.16 93.11,99.26 93.11,100.09 91.99,101.21 91.99,112.11 92.97,113.09 GPIO1.16
PL2
  Top 0.305: EYFI_MEGA.15 93.25,101.77 93.25,111.55 94.37,112.67 94.37,114.34 93.11,115.6 GPIO1.15
PL6
  Top 0.305: GPIO1.14 94.51,111.97 94.51,101.21 95.62,100.09 95.62,99.26 EYFI_MEGA.14
PL7
  Top 0.305: EYFI_MEGA.13 95.76,101.77 95.76,111.55 96.88,112.67 96.88,114.48 95.76,115.6 GPIO1.13
RST
  Top 0.305: EYFI_MEGA.37 49.94,82.77 49.94,83.61 51.06,84.73 51.06,108.76 47.15,112.67 47.15,113.09 PWM2.10
RX1
  Bottom 0.305: UART.7 72.85,115.6 73.97,114.48 73.97,112.53 72.85,111.41 72.85,101.63 EYFI_MEGA.29 72.99,101.63 74.25,100.38 75.79,100.38 76.49,99.68 76.49,98.7 77.32,97.86 82.91,97.86 84.17,96.6 84.17,95.07 61.01,71.91 61.01,19.18 64.33,15.86 67.96,15.86 69.08,16.97 69.92,16.97 CAM.5
RX2
  Bottom 0.305: EYFI_MEGA.27 75.37,101.63 75.37,111.41 76.49,112.53 76.49,114.48 75.37,115.6 UART.5
RX3
  Top 0.305: EYFI_MEGA.25 77.74,101.63 77.74,111.55 76.63,112.67 76.63,114.48 77.74,115.6 UART.3
SCK
  Top 0.305: EYFI_MEGA.76 72.71,50.78 72.71,49.94 71.6,48.82 71.6,38.07 72.71,36.95 SPI1.7
SCL
  Top 0.305: EYFI_MEGA.108 116.86,53.43 116.86,51.48 120.21,48.13 120.21,36.95 I2C.5 120.07,36.95 119.51,36.95 118.12,35.55 117,35.55 104.57,23.12 OLED_1.3 | CAM.3 67.4,16.97 69.08,15.3 86.12,15.3 91.29,20.47 95.76,20.47 99.54,24.24 103.31,24.24 105.12,22.42 OLED_1.3 | OLED2.3 105.12,16.97 105.12,22.14 OLED_1.3 | I2C1.3 I2C2.3
  Bottom 0.305: I2C.5 120.35,36.81 121.47,35.69 123.44,35.69 124.06,36.31 124.06,37.54 124.77,38.25 127.15,38.25 135.8,46.9 I2C2.3 | LF.3 102.75,11.66 102.75,14.46 105.12,16.83 OLED2.3 | GY-87.4 81.93,73.69 68.94,60.7 68.94,22.84 66.15,20.05 66.15,18.23 67.27,17.11 CAM.3
SDA
  Top 0.305: EYFI_MEGA.110 118.67,55.39 118.67,57.07 119.93,58.32 136.35,58.32 138.34,56.33 I2C1.2 138.37,54.55 138.37,49.52 I2C2.2 | OLED2.4 107.78,16.97 107.78,22.28 OLED_1.4 107.78,22.42 118.95,33.6 118.95,34.85 119.65,35.55 120.63,35.55 121.89,36.81 122.73,36.81 I2C.3
  Bottom 0.305: I2C2.2 138.34,50.92 137.63,51.64 131.67,51.64 122.87,42.83 122.87,36.95 I2C.3 | 76.35,18.23 80.68,18.23 81.38,17.53 81.38,16.32 88.12,9.57 103.17,9.57 105.12,11.52 LF.2 105.26,11.66 105.26,12.64 107.64,15.02 107.64,16.83 OLED2.4 | 76.35,18.23 69.5,18.23 68.24,19.49 67.4,19.49 CAM.4 | 76.35,18.23 76.35,20.19 79.14,22.98 79.14,65.73 80.82,67.4 83.19,67.4 84.03,68.24 84.03,74.25 82.07,76.21 GY-87.5
SS0/PB0
  Top 0.305: EYFI_MEGA.73 70.34,48.27 70.34,38.49 71.46,37.37 71.46,35.55 70.34,34.44 SPI1.10
SS1/PJ7
  Bottom 0.305: EYFI_MEGA.74 70.34,50.78 70.34,49.94 71.46,48.82 71.46,38.07 70.34,36.95 SPI1.9
TX1
  Top 0.305: EYFI_MEGA.30 72.85,99.12 72.85,99.95 73.97,101.07 73.97,111.97 72.85,113.09 UART.8
TX2
  Top 0.305: EYFI_MEGA.28 75.37,99.12 75.37,99.95 76.49,101.07 76.49,111.97 75.37,113.09 UART.6
TX3
  Bottom 0.305: EYFI_MEGA.26 77.74,99.12 77.74,99.95 76.63,101.07 76.63,111.83 77.88,113.09 UART.4
XCLK
  Top 0.305: R11.1 74.95,24.52 72.57,24.52 R10.1 72.43,24.38 72.43,19.63 CAM.8

### Text on the board
tPlace: +5V | IO | GND | +5V | IO | GND | D23 | D21 | D5 | D13 | GND | 3A | 4B | 2B | 1A | +5V | +5V | NC | RX1 | RX2 | RX3 | GND | +5V | PH2 | PL0 | PL2 | PL7 | PD5 | PD7 | PG1 | PC1 | PC3 | GND | GND | INT6 | INT4 | +5V | D22 | D19 | TX2 | RX2 | GND | RST | 4C | 4C | 2A | +5V | +5V | NC | TX1 | TX2 | TX3 | GND | +5V | PE2 | PH7 | PL1 | PL6 | PD4 | PD6 | PG0 | PC0 | PC2 | GND | GND | INT7 | INT5 | +5V | PD4 | PD5 | PD6 | PD7 | OC5A | OC5B | INT6 | INT7 | INT4 | INT5 | +5V | +5V | GND | GND | +5V | +5V | ADC0 | ADC1 | ADC2 | ADC3 | ADC4 | ADC5 | ADC6 | ADC7 | ADC8 | ADC9 | ADC10 | ADC11 | ADC12 | ADC13 | ADC14 | ADC15 | GND | GND | GND | SCL | SDA | +5V | GND | SCL | SDA | +5V | VN | D35 | D26 | D12 | GND | 0B | 5A | 5C | +5V | +5V | SS1 / PJ7 | SCK | MOSI | MISO | GND | +5V | PC5 | PC7 | PJ3 | PJ5 | PG2 | PA6 | PA4 | PA2 | PA0 | GND | +5V | SCL | SDA | +5V | VP | D34 | D25 | D14 | GND | 1B | 0A | 5B | +5V | +5V | SS0 / PB0 | PB1 | PB2 | PB3 | GND | +5V | PC4 | PC6 | PJ2 | PJ4 | PJ6 | PA7 | PA5 | PA3 | PA1 | GND | +5V | PD0 | PD1 | +5V | +5V | GND | SCL | SDA | GND | SDA | HS | XCLK | D6 | D4 | D2 | D0 | PWDN | +3.3V | SCL | VS | PCLK | D7 | D5 | D3 | D1 | RESET | +5V | GND | SCL | SDA | 1 | 0 | SRP3